# Altium project slave-12-ltc6811-1.PrjPcb (part 3 of 4)

## Sheet primary_EEPROM_and_T.SchDoc: foxBMS BMS-Slave 12-Cell
size A3; DocumentNumber: 14; SheetNumber: 14; SheetTotal: 21; AUTHOR: Fraunhofer IISB foxBMS Team; SheetDescription: Primary EEPROM and Board T-Sensor
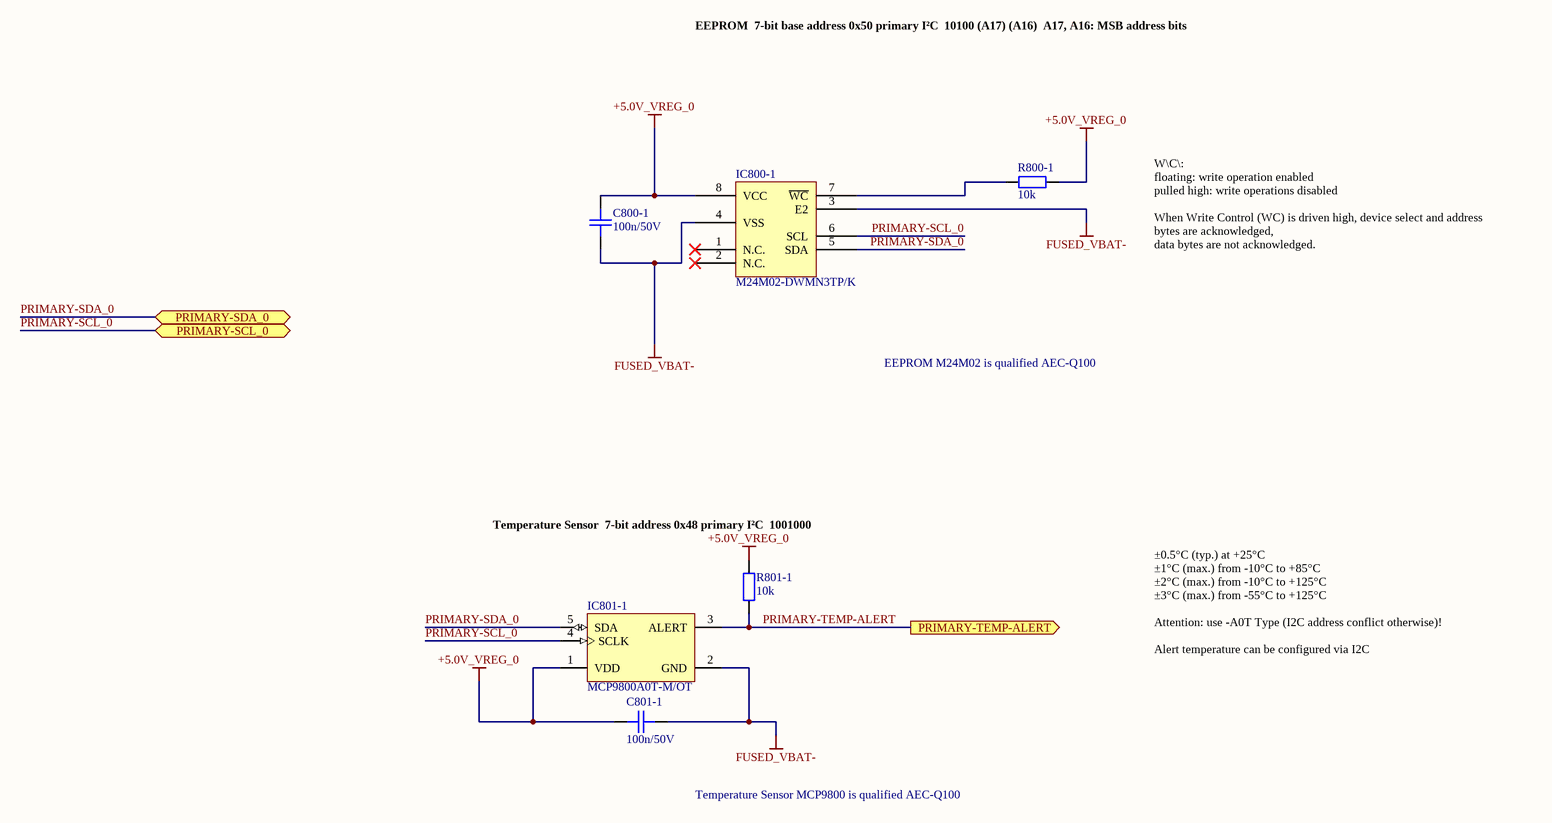
[diagram p12: primary_EEPROM_and_T.SchDoc]

### Parts
C800-1  100n/50V  [CAPC1608X08N]
C801-1  100n/50V  [CAPC1608X08N]
IC800-1  M24M02-DWMN3TP/K  [SOIC127P600X175-8N]
IC801-1  MCP9800A0T-M/OT  [SOT-23-OT5_L]
R800-1  10k  [RESC1608X05N]
R801-1  10k  [RESC1608X05N]

### Ports
PRIMARY-SCL_0 (bidir), PRIMARY-SDA_0 (bidir), PRIMARY-TEMP-ALERT (out)

### Nets
+5.0V_VREG_0: C800-1.2 C801-1.2 IC800-1.8(VCC) IC801-1.1(VDD) R800-1.2 R801-1.2
FUSED_VBAT-: C800-1.1 C801-1.1 IC800-1.3(E2) IC800-1.4(VSS) IC801-1.2(GND)
PRIMARY-SCL_0: IC800-1.6(SCL) IC801-1.4(SCLK) ; port PRIMARY-SCL_0
PRIMARY-SDA_0: IC800-1.5(SDA) IC801-1.5(SDA) ; port PRIMARY-SDA_0
PRIMARY-TEMP-ALERT: IC801-1.3(ALERT) R801-1.1 ; port PRIMARY-TEMP-ALERT
NetIC800-1_7: IC800-1.7(~{WC}) R800-1.1

Not connected (* = marked no-connect by the designer): IC800-1 1(N.C.)* 2(N.C.)*

### Notes on the sheet
- EEPROM
  7-bit base address 0x50 primary I²C
  10100 (A17) (A16)
  A17, A16: MSB address bits
- EEPROM M24M02 is qualified AEC-Q100
- W\C\:
  floating: write operation enabled
  pulled high: write operations disabled
  When Write Control (WC) is driven high, device select and address bytes are acknowledged,
  data bytes are not acknowledged.
- (near R801-1) Temperature Sensor
  7-bit address 0x48 primary I²C
  1001000
- ±0.5°C (typ.) at +25°C
  ±1°C (max.) from -10°C to +85°C
  ±2°C (max.) from -10°C to +125°C
  ±3°C (max.) from -55°C to +125°C
  Attention: use -A0T Type (I2C address conflict otherwise)!
  Alert temperature can be configured via I2C
- Temperature Sensor MCP9800 is qualified AEC-Q100
- Fraunhofer IISB
- Schottkystr. 10
- developed by:
- 91058 Erlangen
- Germany
- Author
- Project
- License
- Description
- File
- Version
- Release Date
- Sheet
- www.foxbms.org
- www.iisb.fraunhofer.de
- foxBMS Team
- /

### Library data of the parts
C800-1 C801-1 = gen_C_ceramic_100n_50V_X7R_0603: MLCC; Capacitance: 100n; Rated Voltage: 50V; Dielectric: X7R; Case EIA: 0603; Case Metric: 1608; PnP Package: C_0603_10; PnP Value: 100n/50V/X7R; PnP equipped: x; Automotive Qualified: False; Part Number: gen_C_ceramic_100n_50V_X7R_0603; Supplier 1: Farnell; Supplier Part Number 1: 2525267; Supplier 2: Digikey; Supplier Part Number 2: 490-6049-1-ND
IC800-1 = M24M02-DWMN3TP/K: Automotive 2-Mbit serial I²C / bus EEPROM with 1 MHz clock; Manufacturer: STMicroelectronics; PnP Package: SO8N; Automotive Qualified: True; Part Number: M24M02-DWMN3TP/K; Part Name: M24M02-DWMN3TP/K; Operating Temperature: -40°C - +125°C; ComponentLink1Description: Datasheet; ComponentLink1URL: http://www.st.com/content/ccc/resource/technical/document/datasheet/83/f4/3e/e4/4e/49/42/c5/DM00200595.pdf/files/DM00200595.pdf/jcr:content/translations/en.DM00200595.pdf; Supplier 1: Digikey; Supplier Part Number 1: 497-16238-1-ND; Supplier 2: Mouser; Supplier Part Number 2: 511-M24M02-DWMN3TP/K
IC801-1 = CMP-0192-00211-1: 2-Wire High-Accuracy Temperature Sensor, Slave Address 000, 5-Pin SOT-23, -55°C to +125°C Temperature, Tape and Reel; PackageReference: SOT-23-OT5; PackageVersion: revBB, Aug-2009; DatasheetVersion: revD, Nov-2010; PackageDescription: 5-Lead Plastic Small Outline Transistor (OT) [SOT-23]; Code_IPC: SOT23-5
R800-1 R801-1 = gen_R_10k_0603: as R700-1 on sheet primary_DIO; Part Number: gen_R_10k_0603; Operating Temperature: -55°C - +155°C; Resistance: 10k; Series: E24, E96; PnP Value: 10k; Supplier 1: Farnell; Supplier Part Number 1: 2073349

## Sheet secondary_EEPROM_and_T.SchDoc: foxBMS BMS-Slave 12-Cell
size A3; DocumentNumber: 20; SheetNumber: 20; SheetTotal: 21; AUTHOR: Fraunhofer IISB foxBMS Team; SheetDescription: Secondary EEPROM and Board T-Sensor
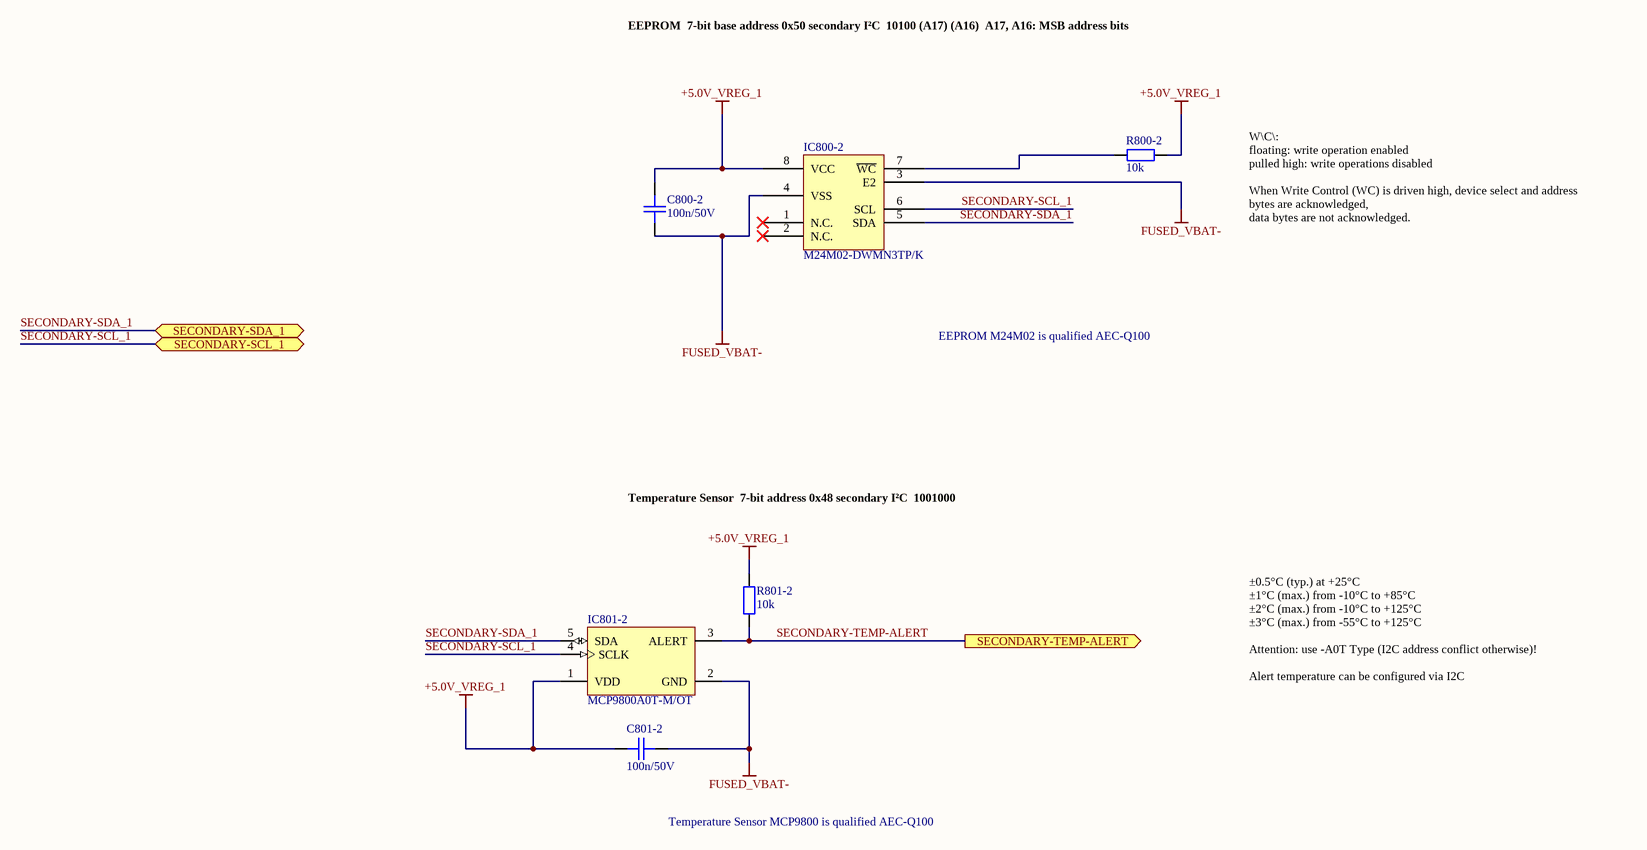
[diagram p13: secondary_EEPROM_and_T.SchDoc]

### Parts
C800-2  100n/50V  [CAPC1608X08N]
C801-2  100n/50V  [CAPC1608X08N]
IC800-2  M24M02-DWMN3TP/K  [SOIC127P600X175-8N]
IC801-2  MCP9800A0T-M/OT  [SOT-23-OT5_L]
R800-2  10k  [RESC1608X05N]
R801-2  10k  [RESC1608X05N]

### Ports
SECONDARY-SCL_1 (bidir), SECONDARY-SDA_1 (bidir), SECONDARY-TEMP-ALERT (out)

### Nets
+5.0V_VREG_1: C800-2.2 C801-2.2 IC800-2.8(VCC) IC801-2.1(VDD) R800-2.2 R801-2.2
FUSED_VBAT-: C800-2.1 C801-2.1 IC800-2.3(E2) IC800-2.4(VSS) IC801-2.2(GND)
SECONDARY-SCL_1: IC800-2.6(SCL) IC801-2.4(SCLK) ; port SECONDARY-SCL_1
SECONDARY-SDA_1: IC800-2.5(SDA) IC801-2.5(SDA) ; port SECONDARY-SDA_1
SECONDARY-TEMP-ALERT: IC801-2.3(ALERT) R801-2.1 ; port SECONDARY-TEMP-ALERT
NetIC800-2_7: IC800-2.7(~{WC}) R800-2.1

Not connected (* = marked no-connect by the designer): IC800-2 1(N.C.)* 2(N.C.)*

### Notes on the sheet
- EEPROM
  7-bit base address 0x50 secondary I²C
  10100 (A17) (A16)
  A17, A16: MSB address bits
- W\C\:
  floating: write operation enabled
  pulled high: write operations disabled
  When Write Control (WC) is driven high, device select and address bytes are acknowledged,
  data bytes are not acknowledged.
- EEPROM M24M02 is qualified AEC-Q100
- Temperature Sensor
  7-bit address 0x48 secondary I²C
  1001000
- ±0.5°C (typ.) at +25°C
  ±1°C (max.) from -10°C to +85°C
  ±2°C (max.) from -10°C to +125°C
  ±3°C (max.) from -55°C to +125°C
  Attention: use -A0T Type (I2C address conflict otherwise)!
  Alert temperature can be configured via I2C
- Temperature Sensor MCP9800 is qualified AEC-Q100
- Fraunhofer IISB
- Schottkystr. 10
- developed by:
- 91058 Erlangen
- Germany
- Author
- Project
- License
- Description
- File
- Version
- Release Date
- Sheet
- www.foxbms.org
- www.iisb.fraunhofer.de
- foxBMS Team
- /

### Library data of the parts
C800-2 C801-2 = gen_C_ceramic_100n_50V_X7R_0603: as C800-1 on sheet primary_EEPROM_and_T; Part Number: gen_C_ceramic_100n_50V_X7R_0603; Supplier 1: Farnell; Supplier Part Number 1: 2525267; Supplier 2: Digikey; Supplier Part Number 2: 490-6049-1-ND
IC800-2 = M24M02-DWMN3TP/K: as IC800-1 on sheet primary_EEPROM_and_T; Part Number: M24M02-DWMN3TP/K; Part Name: M24M02-DWMN3TP/K; Operating Temperature: -40°C - +125°C; ComponentLink1Description: Datasheet; ComponentLink1URL: http://www.st.com/content/ccc/resource/technical/document/datasheet/83/f4/3e/e4/4e/49/42/c5/DM00200595.pdf/files/DM00200595.pdf/jcr:content/translations/en.DM00200595.pdf; Supplier 1: Digikey; Supplier Part Number 1: 497-16238-1-ND; Supplier 2: Mouser; Supplier Part Number 2: 511-M24M02-DWMN3TP/K
IC801-2 = CMP-0192-00211-1: as IC801-1 on sheet primary_EEPROM_and_T; PackageReference: SOT-23-OT5; PackageVersion: revBB, Aug-2009; DatasheetVersion: revD, Nov-2010; PackageDescription: 5-Lead Plastic Small Outline Transistor (OT) [SOT-23]; Code_IPC: SOT23-5
R800-2 R801-2 = gen_R_10k_0603: as R700-1 on sheet primary_DIO; Part Number: gen_R_10k_0603; Operating Temperature: -55°C - +155°C; Resistance: 10k; Series: E24, E96; PnP Value: 10k; Supplier 1: Farnell; Supplier Part Number 1: 2073349

## Sheet prim_analog_in.SchDoc: foxBMS BMS-Slave 12-Cell
size A3; DocumentNumber: 10; SheetNumber: 10; SheetTotal: 21; AUTHOR: Fraunhofer IISB foxBMS Team; SheetDescription: Primary Analog Inputs
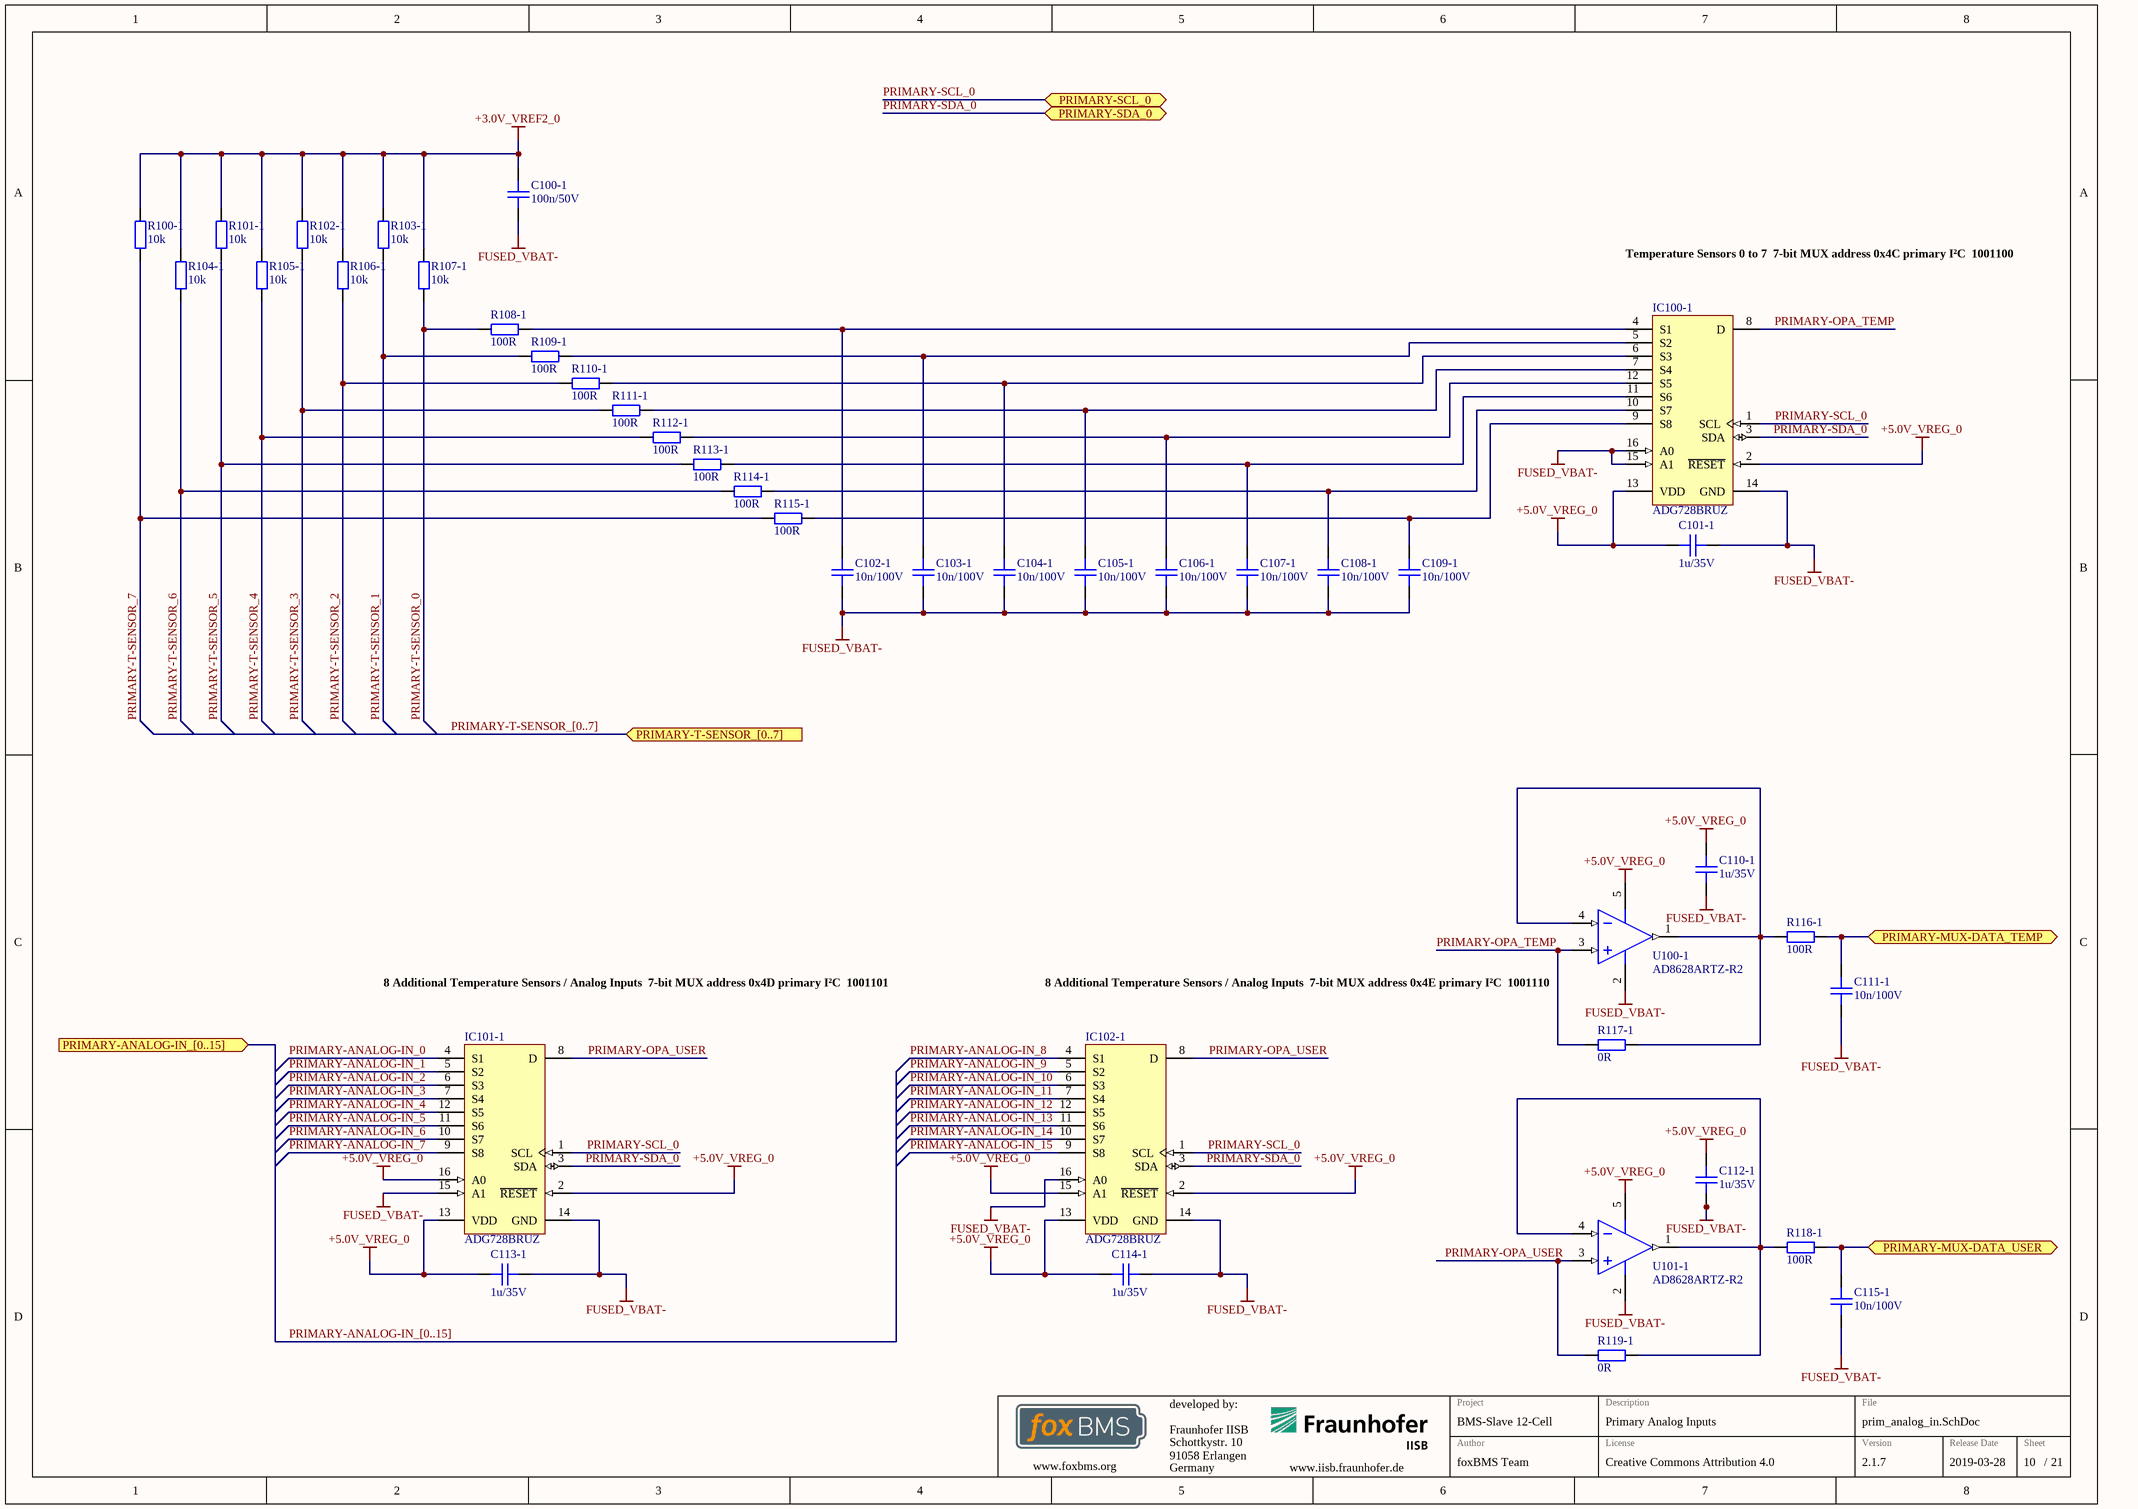
[diagram p14: prim_analog_in.SchDoc]

### Parts
C100-1  100n/50V  [CAPC1608X08N]
C101-1  1u/35V  [CAPC1608X08N]
C102-1  10n/100V  [CAPC1608X08N]
C103-1  10n/100V  [CAPC1608X08N]
C104-1  10n/100V  [CAPC1608X08N]
C105-1  10n/100V  [CAPC1608X08N]
C106-1  10n/100V  [CAPC1608X08N]
C107-1  10n/100V  [CAPC1608X08N]
C108-1  10n/100V  [CAPC1608X08N]
C109-1  10n/100V  [CAPC1608X08N]
C110-1  1u/35V  [CAPC1608X08N]
C111-1  10n/100V  [CAPC1608X08N]
C112-1  1u/35V  [CAPC1608X08N]
C113-1  1u/35V  [CAPC1608X08N]
C114-1  1u/35V  [CAPC1608X08N]
C115-1  10n/100V  [CAPC1608X08N]
IC100-1  ADG728BRUZ  [ADI-RU-16_M]
IC101-1  ADG728BRUZ  [ADI-RU-16_M]
IC102-1  ADG728BRUZ  [ADI-RU-16_M]
R100-1  10k  [RESC1608X05N]
R101-1  10k  [RESC1608X05N]
R102-1  10k  [RESC1608X05N]
R103-1  10k  [RESC1608X05N]
R104-1  10k  [RESC1608X05N]
R105-1  10k  [RESC1608X05N]
R106-1  10k  [RESC1608X05N]
R107-1  10k  [RESC1608X05N]
R108-1  100R  [RESC1608X05N]
R109-1  100R  [RESC1608X05N]
R110-1  100R  [RESC1608X05N]
R111-1  100R  [RESC1608X05N]
R112-1  100R  [RESC1608X05N]
R113-1  100R  [RESC1608X05N]
R114-1  100R  [RESC1608X05N]
R115-1  100R  [RESC1608X05N]
R116-1  100R  [RESC1608X05N]
R117-1  0R  [RESC1608X05N]
R118-1  100R  [RESC1608X05N]
R119-1  0R  [RESC1608X05N]
U100-1  AD8628ARTZ-R2  [ADI-RJ-5_M]
U101-1  AD8628ARTZ-R2  [ADI-RJ-5_M]

### Ports
PRIMARY-ANALOG-IN_[0..15] (in), PRIMARY-MUX-DATA_TEMP (bidir), PRIMARY-MUX-DATA_USER (bidir), PRIMARY-SCL_0 (bidir), PRIMARY-SDA_0 (bidir), PRIMARY-T-SENSOR_[0..7] (in)

### Nets
+3.0V_VREF2_0: C100-1.2 R100-1.2 R101-1.2 R102-1.2 R103-1.2 R104-1.2 R105-1.2 R106-1.2 R107-1.2
+5.0V_VREG_0: C101-1.2 C110-1.2 C112-1.2 C113-1.2 C114-1.2 IC100-1.2(~{RESET}) IC100-1.13(VDD) IC101-1.2(~{RESET}) IC101-1.13(VDD) IC101-1.16(A0) IC102-1.2(~{RESET}) IC102-1.13(VDD) IC102-1.15(A1) U100-1.5(+V) U101-1.5(+V)
FUSED_VBAT-: C100-1.1 C101-1.1 C102-1.1 C103-1.1 C104-1.1 C105-1.1 C106-1.1 C107-1.1 C108-1.1 C109-1.1 C110-1.1 C111-1.1 C112-1.1 C113-1.1 C114-1.1 C115-1.1 IC100-1.14(GND) IC100-1.15(A1) IC100-1.16(A0) IC101-1.14(GND) IC101-1.15(A1) IC102-1.14(GND) IC102-1.16(A0) U100-1.2(-V) U101-1.2(-V)
PRIMARY-ANALOG-IN_0: IC101-1.4(S1)
PRIMARY-ANALOG-IN_1: IC101-1.5(S2)
PRIMARY-ANALOG-IN_2: IC101-1.6(S3)
PRIMARY-ANALOG-IN_3: IC101-1.7(S4)
PRIMARY-ANALOG-IN_4: IC101-1.12(S5)
PRIMARY-ANALOG-IN_5: IC101-1.11(S6)
PRIMARY-ANALOG-IN_6: IC101-1.10(S7)
PRIMARY-ANALOG-IN_7: IC101-1.9(S8)
PRIMARY-ANALOG-IN_8: IC102-1.4(S1)
PRIMARY-ANALOG-IN_9: IC102-1.5(S2)
PRIMARY-ANALOG-IN_10: IC102-1.6(S3)
PRIMARY-ANALOG-IN_11: IC102-1.7(S4)
PRIMARY-ANALOG-IN_12: IC102-1.12(S5)
PRIMARY-ANALOG-IN_13: IC102-1.11(S6)
PRIMARY-ANALOG-IN_14: IC102-1.10(S7)
PRIMARY-ANALOG-IN_15: IC102-1.9(S8)
PRIMARY-MUX-DATA_TEMP: C111-1.2 R116-1.2 ; port PRIMARY-MUX-DATA_TEMP
PRIMARY-MUX-DATA_USER: C115-1.2 R118-1.2 ; port PRIMARY-MUX-DATA_USER
PRIMARY-OPA_TEMP: IC100-1.8(D) R117-1.1 U100-1.3(+IN)
PRIMARY-OPA_USER: IC101-1.8(D) IC102-1.8(D) R119-1.1 U101-1.3(+IN)
PRIMARY-SCL_0: IC100-1.1(SCL) IC101-1.1(SCL) IC102-1.1(SCL) ; port PRIMARY-SCL_0
PRIMARY-SDA_0: IC100-1.3(SDA) IC101-1.3(SDA) IC102-1.3(SDA) ; port PRIMARY-SDA_0
PRIMARY-T-SENSOR_0: R107-1.1 R108-1.2
PRIMARY-T-SENSOR_1: R103-1.1 R109-1.2
PRIMARY-T-SENSOR_2: R106-1.1 R110-1.2
PRIMARY-T-SENSOR_3: R102-1.1 R111-1.2
PRIMARY-T-SENSOR_4: R105-1.1 R112-1.2
PRIMARY-T-SENSOR_5: R101-1.1 R113-1.2
PRIMARY-T-SENSOR_6: R104-1.1 R114-1.2
PRIMARY-T-SENSOR_7: R100-1.1 R115-1.2
NetC102-1_2: C102-1.2 IC100-1.4(S1) R108-1.1
NetC103-1_2: C103-1.2 IC100-1.5(S2) R109-1.1
NetC104-1_2: C104-1.2 IC100-1.6(S3) R110-1.1
NetC105-1_2: C105-1.2 IC100-1.7(S4) R111-1.1
NetC106-1_2: C106-1.2 IC100-1.12(S5) R112-1.1
NetC107-1_2: C107-1.2 IC100-1.11(S6) R113-1.1
NetC108-1_2: C108-1.2 IC100-1.10(S7) R114-1.1
NetC109-1_2: C109-1.2 IC100-1.9(S8) R115-1.1
NetR116-1_1: R116-1.1 R117-1.2 U100-1.1(OUT) U100-1.4(-IN)
NetR118-1_1: R118-1.1 R119-1.2 U101-1.1(OUT) U101-1.4(-IN)

### Buses and harness runs
bus PRIMARY-ANALOG-IN_[0..15] = port PRIMARY-ANALOG-IN_[0..15]
bus PRIMARY-T-SENSOR_[0..7] = port PRIMARY-T-SENSOR_[0..7]

### Notes on the sheet
- Temperature Sensors 0 to 7
  7-bit MUX address 0x4C primary I²C
  1001100
- 8 Additional Temperature Sensors / Analog Inputs
  7-bit MUX address 0x4D primary I²C
  1001101
- (near U100-1) 8 Additional Temperature Sensors / Analog Inputs
  7-bit MUX address 0x4E primary I²C
  1001110
- Fraunhofer IISB
- Schottkystr. 10
- developed by:
- 91058 Erlangen
- Germany
- Author
- Project
- License
- Description
- File
- Version
- Release Date
- Sheet
- www.foxbms.org
- www.iisb.fraunhofer.de
- foxBMS Team
- /

### Library data of the parts
C100-1 = gen_C_ceramic_100n_50V_X7R_0603: as C700-1 on sheet primary_DIO; Part Number: gen_C_ceramic_100n_50V_X7R_0603; Supplier 1: Farnell; Supplier Part Number 1: 2525267; Supplier 2: Digikey; Supplier Part Number 2: 490-6049-1-ND; Supplier 3: Farnell; Supplier Part Number 3: 2070398
C101-1 C110-1 C112-1 C113-1 C114-1 = gen_C_ceramic_1u_35V_X7R_0603: as C1401-1 on sheet primary_LTC; Part Number: gen_C_ceramic_1u_35V_X7R_0603; Supplier 1: Farnell; Supplier Part Number 1: 1907508
C102-1 C103-1 C104-1 C105-1 C106-1 C107-1 C108-1 C109-1 C111-1 C115-1 = gen_C_ceramic_10n_100V_X7R_0603: MLCC; Capacitance: 10n; Rated Voltage: 100V; Dielectric: X7R; Case EIA: 0603; Case Metric: 1608; Automotive Qualified: True; PnP Package: C_0603_10; PnP Value: 10n/100V/X7R; Part Number: gen_C_ceramic_10n_100V_X7R_0603; Supplier 1: Farnell; Supplier Part Number 1: 1301715; Supplier 2: Farnell; Supplier Part Number 2: 2821192; Supplier 3: Farnell; Supplier Part Number 3: 2210878
IC100-1 IC101-1 IC102-1 = CMP-0798-00197-1: CMOS, Low Voltage, 2-Wire Serially Controlled, Matrix Switch, -40 to 85 degC, 16-pin SOP (RU-16), Tube; Manufacturer: Analog Devices; Ron (ohms): 2.5; Supply V Guar Performance: Single_(+3V), Single_(+5V); Max Analog Signal Range: 0 to Vdd; Bandwidth (Hz): 65M; ComponentLink3Description: Package Specification; Packing: Tube; PartNumber: ADG728BRUZ; ComponentLink1URL: http://www.analog.com/en/index.html; Mounting Technology: Surface Mount; DatasheetVersion: Rev. C; ComponentLink1Description: Manufacturer URL; ComponentLink3URL: http:/www.analog.com/static/imported-files/packages/36244347913743854010197452789RU16.pdf; ComponentLink2URL: http://www.analog.com/static/imported-files/data_sheets/ADG728_729.pdf; PackageVersion: Nov-02; PackageDescription: 16-Pin Thin Shrink Small Outline Package, Body 5 x 4.4 mm, Pitch 0.65 mm; Code_JEDEC: MO-153AB; PackageReference: RU-16; ComponentLink2Description: Datasheet
R100-1 R101-1 R102-1 R103-1 R104-1 R105-1 R106-1 R107-1 = gen_R_10k_0603: as R1404-1 on sheet primary_LTC; Part Number: gen_R_10k_0603; Operating Temperature: -55°C - +155°C; Resistance: 10k; Series: E24, E96; PnP Value: 10k; Supplier 1: Farnell; Supplier Part Number 1: 2073349
R108-1 R109-1 R110-1 R111-1 R112-1 R113-1 R114-1 R115-1 = gen_R_100R_0603: SMD Resistor 100R 0603; Tolerance: 1%; Power: 0.1W; Case EIA: 0603; Case Metric: 1608; Maximum Working Voltage: 75V; PnP Package: R_0603; Automotive Qualified: True; Part Number: gen_R_100R_0603; Operating Temperature: -55°C - +155°C; Resistance: 100R; Series: E24, E96; PnP Value: 100R; Supplier 1: Digikey; Supplier Part Number 1: P100HCT-ND
R116-1 R118-1 = gen_R_100R_0603: SMD Resistor 100R 0603; Tolerance: 1%; Power: 0.1W; Case EIA: 0603; Case Metric: 1608; Maximum Working Voltage: 75V; PnP Package: R_0603; Automotive Qualified: False; Part Number: gen_R_100R_0603; Operating Temperature: -55°C - +155°C; Resistance: 100R; Series: E24, E96; PnP Value: 100R; Supplier 1: Farnell; Supplier Part Number 1: 1469752
R117-1 R119-1 = gen_R_0R_0603: SMD Resistor 0R 0603; Power: 0.1W; Case EIA: 0603; Case Metric: 1608; Maximum Working Voltage: 75V; PnP Package: R_0603; Automotive Qualified: True; Part Number: gen_R_0R_0603; Operating Temperature: -55°C - +155°C; Resistance: 0R; Series: Jumper; PnP Value: 0R; Supplier 1: Farnell; Supplier Part Number 1: 2616580
U100-1 U101-1 = CMP-0384-01512-2: Single Channel RRIO Operational Amplifier, 2.5 MHz BW, 1 V/us SR, Industrial, 5-pin SOT23 (RJ-5), Reel; Manufacturer: Analog Devices; Generic Part Number: AD8628; Iq/Amp: 1.1mA; Automotive Qualified: Yes; V Span Max: 6V; Input Bias Current: 30pA; Slew Rate: 1V/us; Amplifiers Per Package: 1; Input Offset Voltage: 1uV; Small Signal Bandwidth: 2.5MHz; V Span Min: 2.7V; ComponentLink1Description: Manufacturer URL; DatasheetVersion: Rev. I; ComponentLink4Description: Reference Circuit; Code_JEDEC: MO-178-AA; PackageDescription: 5-Pin Small Outline Transistor Package, Body 2.9 x 1.6 mm, Pitch 0.95 mm; ComponentLink3URL: http://www.analog.com/static/imported-files/packages/PKG_PDF/SOT-23(RJ)/RJ_5.pdf; PackageReference: RJ-5; ComponentLink1URL: http://www.analog.com/en/index.html; PackageVersion: 121608-A; RevisionNote: Reference Circuit URL fixed; Mounting Technology: Surface Mount; ComponentLink2Description: Datasheet; ComponentLink3Description: Package Specification; ComponentLink4URL: http://www.analog.com/en/all-operational-amplifiers-op-amps/operational-amplifiers-op-amps/ad8628/products/product.html#product-recommendations; ComponentLink2URL: http://www.analog.com/static/imported-files/data_sheets/AD8628_8629_8630.pdf; PartNumber: AD8628ARTZ-R2

## Sheet secon_analog_in.SchDoc: foxBMS BMS-Slave 12-Cell
size A3; DocumentNumber: 16; SheetNumber: 16; SheetTotal: 21; AUTHOR: Fraunhofer IISB foxBMS Team; SheetDescription: Secondary Analog Inputs
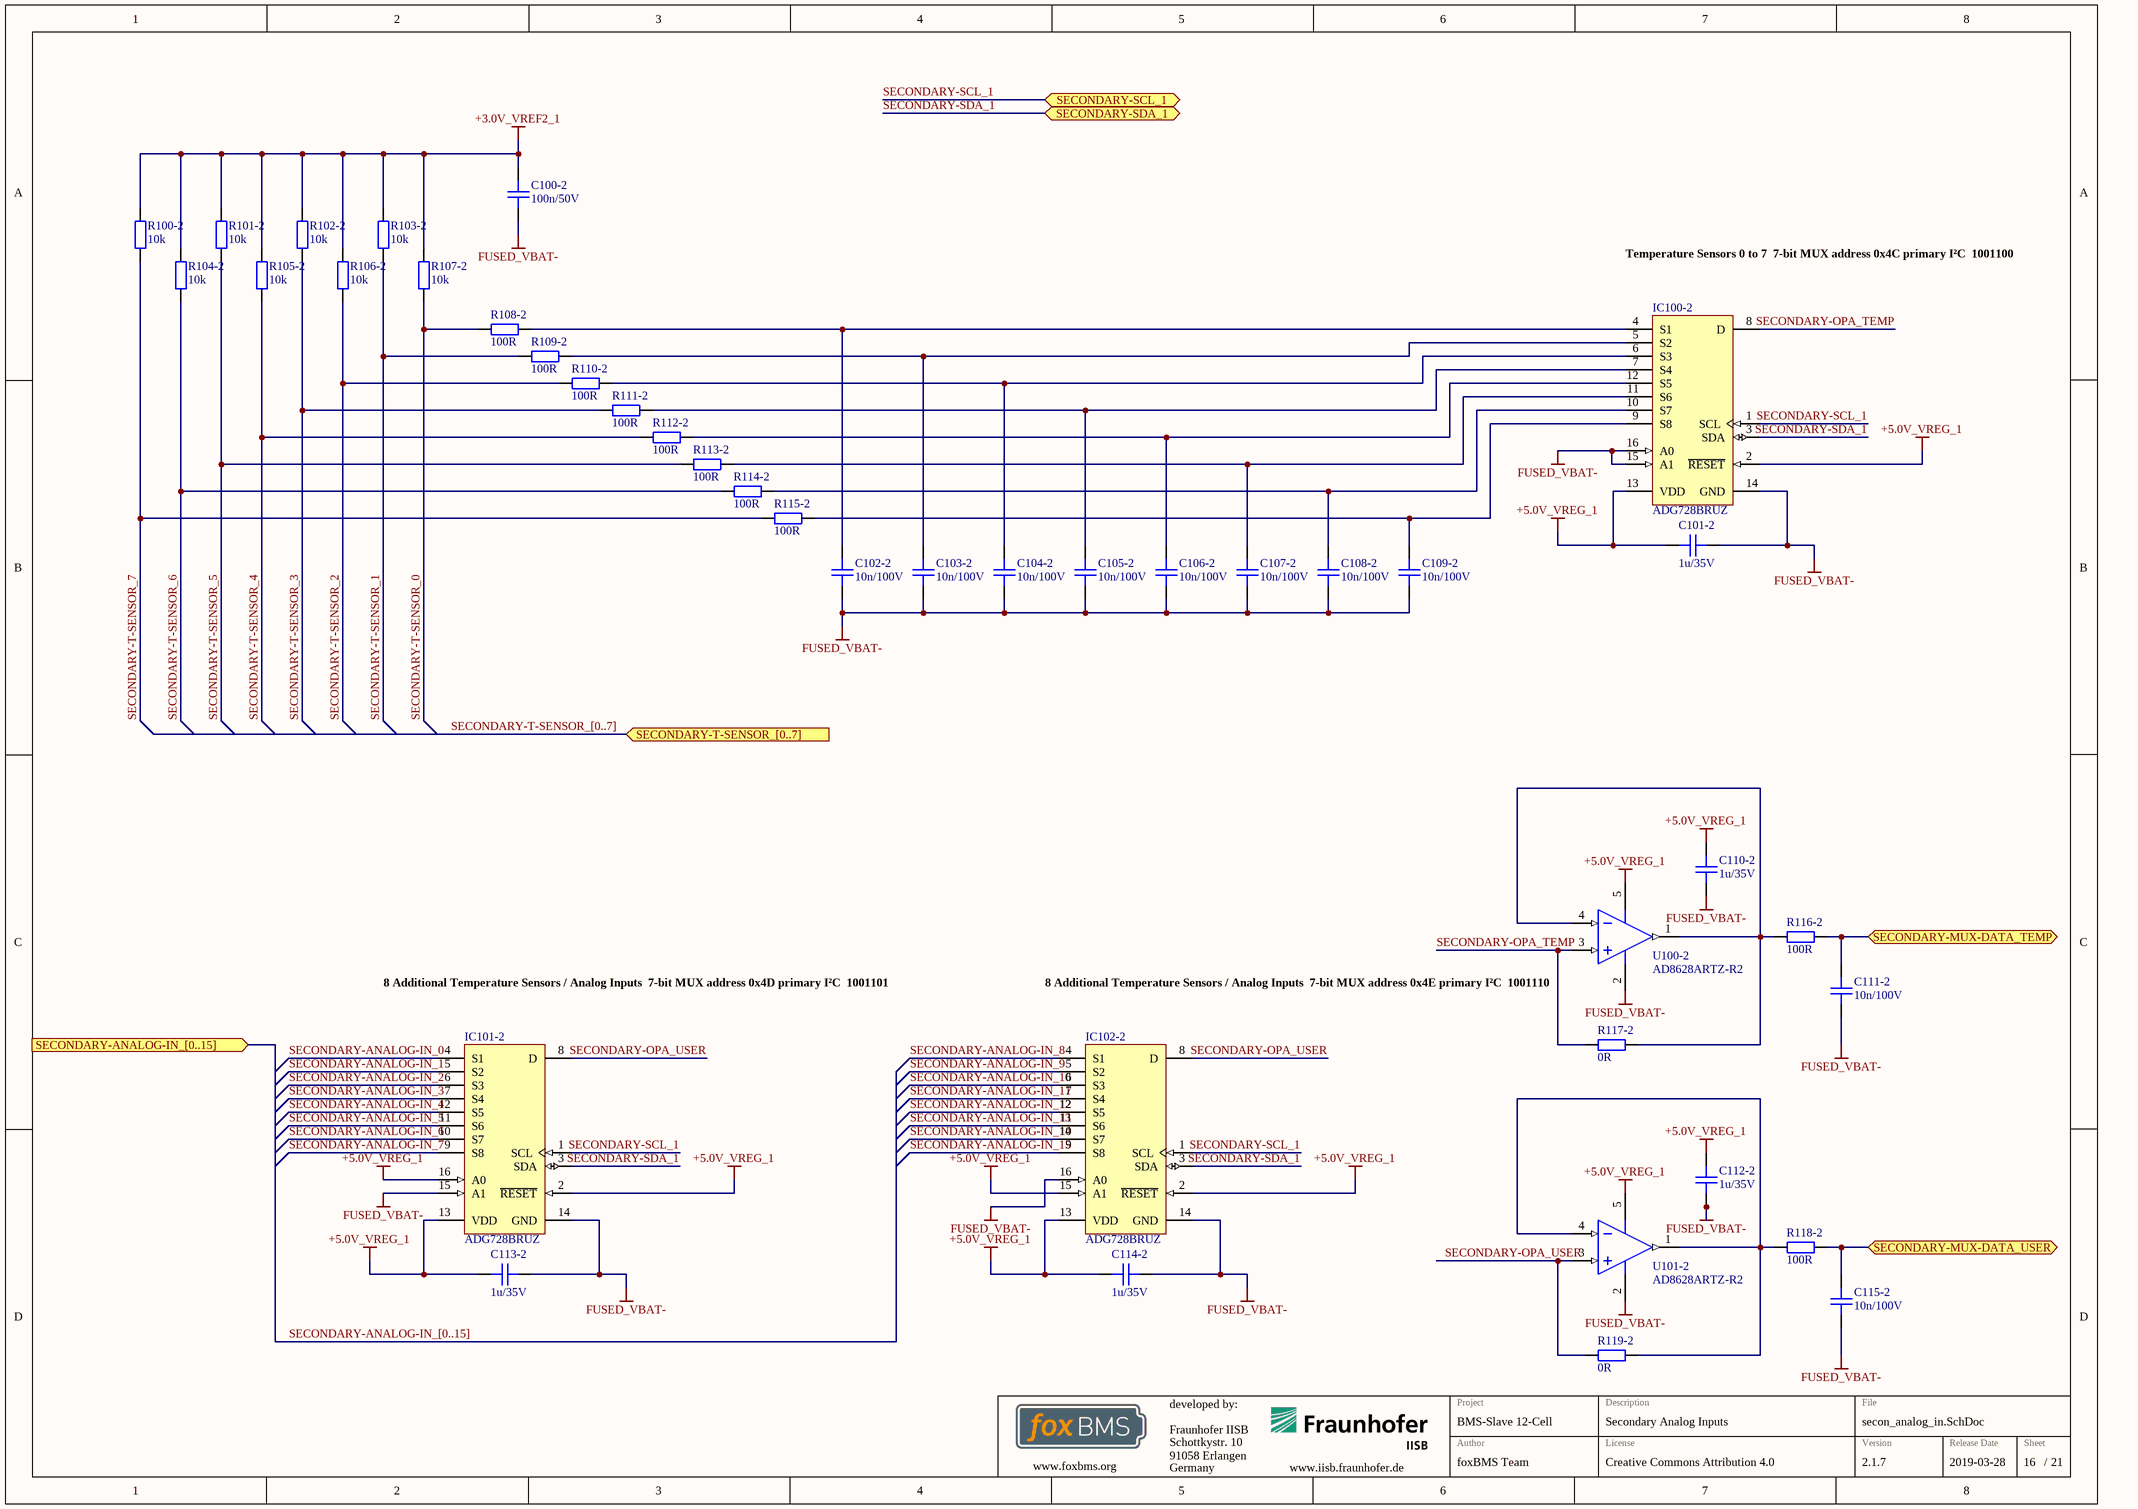
[diagram p15: secon_analog_in.SchDoc]

### Parts
C100-2  100n/50V  [CAPC1608X08N]
C101-2  1u/35V  [CAPC1608X08N]
C102-2  10n/100V  [CAPC1608X08N]
C103-2  10n/100V  [CAPC1608X08N]
C104-2  10n/100V  [CAPC1608X08N]
C105-2  10n/100V  [CAPC1608X08N]
C106-2  10n/100V  [CAPC1608X08N]
C107-2  10n/100V  [CAPC1608X08N]
C108-2  10n/100V  [CAPC1608X08N]
C109-2  10n/100V  [CAPC1608X08N]
C110-2  1u/35V  [CAPC1608X08N]
C111-2  10n/100V  [CAPC1608X08N]
C112-2  1u/35V  [CAPC1608X08N]
C113-2  1u/35V  [CAPC1608X08N]
C114-2  1u/35V  [CAPC1608X08N]
C115-2  10n/100V  [CAPC1608X08N]
IC100-2  ADG728BRUZ  [ADI-RU-16_M]
IC101-2  ADG728BRUZ  [ADI-RU-16_M]
IC102-2  ADG728BRUZ  [ADI-RU-16_M]
R100-2  10k  [RESC1608X05N]
R101-2  10k  [RESC1608X05N]
R102-2  10k  [RESC1608X05N]
R103-2  10k  [RESC1608X05N]
R104-2  10k  [RESC1608X05N]
R105-2  10k  [RESC1608X05N]
R106-2  10k  [RESC1608X05N]
R107-2  10k  [RESC1608X05N]
R108-2  100R  [RESC1608X05N]
R109-2  100R  [RESC1608X05N]
R110-2  100R  [RESC1608X05N]
R111-2  100R  [RESC1608X05N]
R112-2  100R  [RESC1608X05N]
R113-2  100R  [RESC1608X05N]
R114-2  100R  [RESC1608X05N]
R115-2  100R  [RESC1608X05N]
R116-2  100R  [RESC1608X05N]
R117-2  0R  [RESC1608X05N]
R118-2  100R  [RESC1608X05N]
R119-2  0R  [RESC1608X05N]
U100-2  AD8628ARTZ-R2  [ADI-RJ-5_M]
U101-2  AD8628ARTZ-R2  [ADI-RJ-5_M]

### Ports
SECONDARY-ANALOG-IN_[0..15] (in), SECONDARY-MUX-DATA_TEMP (bidir), SECONDARY-MUX-DATA_USER (bidir), SECONDARY-SCL_1 (bidir), SECONDARY-SDA_1 (bidir), SECONDARY-T-SENSOR_[0..7] (in)

### Nets
+3.0V_VREF2_1: C100-2.2 R100-2.2 R101-2.2 R102-2.2 R103-2.2 R104-2.2 R105-2.2 R106-2.2 R107-2.2
+5.0V_VREG_1: C101-2.2 C110-2.2 C112-2.2 C113-2.2 C114-2.2 IC100-2.2(~{RESET}) IC100-2.13(VDD) IC101-2.2(~{RESET}) IC101-2.13(VDD) IC101-2.16(A0) IC102-2.2(~{RESET}) IC102-2.13(VDD) IC102-2.15(A1) U100-2.5(+V) U101-2.5(+V)
FUSED_VBAT-: C100-2.1 C101-2.1 C102-2.1 C103-2.1 C104-2.1 C105-2.1 C106-2.1 C107-2.1 C108-2.1 C109-2.1 C110-2.1 C111-2.1 C112-2.1 C113-2.1 C114-2.1 C115-2.1 IC100-2.14(GND) IC100-2.15(A1) IC100-2.16(A0) IC101-2.14(GND) IC101-2.15(A1) IC102-2.14(GND) IC102-2.16(A0) U100-2.2(-V) U101-2.2(-V)
SECONDARY-ANALOG-IN_0: IC101-2.4(S1)
SECONDARY-ANALOG-IN_1: IC101-2.5(S2)
SECONDARY-ANALOG-IN_2: IC101-2.6(S3)
SECONDARY-ANALOG-IN_3: IC101-2.7(S4)
SECONDARY-ANALOG-IN_4: IC101-2.12(S5)
SECONDARY-ANALOG-IN_5: IC101-2.11(S6)
SECONDARY-ANALOG-IN_6: IC101-2.10(S7)
SECONDARY-ANALOG-IN_7: IC101-2.9(S8)
SECONDARY-ANALOG-IN_8: IC102-2.4(S1)
SECONDARY-ANALOG-IN_9: IC102-2.5(S2)
SECONDARY-ANALOG-IN_10: IC102-2.6(S3)
SECONDARY-ANALOG-IN_11: IC102-2.7(S4)
SECONDARY-ANALOG-IN_12: IC102-2.12(S5)
SECONDARY-ANALOG-IN_13: IC102-2.11(S6)
SECONDARY-ANALOG-IN_14: IC102-2.10(S7)
SECONDARY-ANALOG-IN_15: IC102-2.9(S8)
SECONDARY-MUX-DATA_TEMP: C111-2.2 R116-2.2 ; port SECONDARY-MUX-DATA_TEMP
SECONDARY-MUX-DATA_USER: C115-2.2 R118-2.2 ; port SECONDARY-MUX-DATA_USER
SECONDARY-OPA_TEMP: IC100-2.8(D) R117-2.1 U100-2.3(+IN)
SECONDARY-OPA_USER: IC101-2.8(D) IC102-2.8(D) R119-2.1 U101-2.3(+IN)
SECONDARY-SCL_1: IC100-2.1(SCL) IC101-2.1(SCL) IC102-2.1(SCL) ; port SECONDARY-SCL_1
SECONDARY-SDA_1: IC100-2.3(SDA) IC101-2.3(SDA) IC102-2.3(SDA) ; port SECONDARY-SDA_1
SECONDARY-T-SENSOR_0: R107-2.1 R108-2.2
SECONDARY-T-SENSOR_1: R103-2.1 R109-2.2
SECONDARY-T-SENSOR_2: R106-2.1 R110-2.2
SECONDARY-T-SENSOR_3: R102-2.1 R111-2.2
SECONDARY-T-SENSOR_4: R105-2.1 R112-2.2
SECONDARY-T-SENSOR_5: R101-2.1 R113-2.2
SECONDARY-T-SENSOR_6: R104-2.1 R114-2.2
SECONDARY-T-SENSOR_7: R100-2.1 R115-2.2
NetC102-2_2: C102-2.2 IC100-2.4(S1) R108-2.1
NetC103-2_2: C103-2.2 IC100-2.5(S2) R109-2.1
NetC104-2_2: C104-2.2 IC100-2.6(S3) R110-2.1
NetC105-2_2: C105-2.2 IC100-2.7(S4) R111-2.1
NetC106-2_2: C106-2.2 IC100-2.12(S5) R112-2.1
NetC107-2_2: C107-2.2 IC100-2.11(S6) R113-2.1
NetC108-2_2: C108-2.2 IC100-2.10(S7) R114-2.1
NetC109-2_2: C109-2.2 IC100-2.9(S8) R115-2.1
NetR116-2_1: R116-2.1 R117-2.2 U100-2.1(OUT) U100-2.4(-IN)
NetR118-2_1: R118-2.1 R119-2.2 U101-2.1(OUT) U101-2.4(-IN)

### Buses and harness runs
bus SECONDARY-ANALOG-IN_[0..15] = port SECONDARY-ANALOG-IN_[0..15]
bus SECONDARY-T-SENSOR_[0..7] = port SECONDARY-T-SENSOR_[0..7]

### Notes on the sheet
- Temperature Sensors 0 to 7
  7-bit MUX address 0x4C primary I²C
  1001100
- 8 Additional Temperature Sensors / Analog Inputs
  7-bit MUX address 0x4D primary I²C
  1001101
- (near U100-2) 8 Additional Temperature Sensors / Analog Inputs
  7-bit MUX address 0x4E primary I²C
  1001110
- Fraunhofer IISB
- Schottkystr. 10
- developed by:
- 91058 Erlangen
- Germany
- Author
- Project
- License
- Description
- File
- Version
- Release Date
- Sheet
- www.foxbms.org
- www.iisb.fraunhofer.de
- foxBMS Team
- /

### Library data of the parts
C100-2 = gen_C_ceramic_100n_50V_X7R_0603: as C700-1 on sheet primary_DIO; Part Number: gen_C_ceramic_100n_50V_X7R_0603; Supplier 1: Farnell; Supplier Part Number 1: 2525267; Supplier 2: Digikey; Supplier Part Number 2: 490-6049-1-ND; Supplier 3: Farnell; Supplier Part Number 3: 2070398
C101-2 C110-2 C112-2 C113-2 C114-2 = gen_C_ceramic_1u_35V_X7R_0603: as C1401-1 on sheet primary_LTC; Part Number: gen_C_ceramic_1u_35V_X7R_0603; Supplier 1: Farnell; Supplier Part Number 1: 1907508
C102-2 C103-2 C104-2 C105-2 C106-2 C107-2 C108-2 C109-2 C111-2 C115-2 = gen_C_ceramic_10n_100V_X7R_0603: as C102-1 on sheet prim_analog_in; Part Number: gen_C_ceramic_10n_100V_X7R_0603; Supplier 1: Farnell; Supplier Part Number 1: 1301715; Supplier 2: Farnell; Supplier Part Number 2: 2821192; Supplier 3: Farnell; Supplier Part Number 3: 2210878
IC100-2 IC101-2 IC102-2 = CMP-0798-00197-1: as IC100-1 on sheet prim_analog_in; ComponentLink3Description: Package Specification; Packing: Tube; PartNumber: ADG728BRUZ; ComponentLink1URL: http://www.analog.com/en/index.html; Mounting Technology: Surface Mount; DatasheetVersion: Rev. C; ComponentLink1Description: Manufacturer URL; ComponentLink3URL: http:/www.analog.com/static/imported-files/packages/36244347913743854010197452789RU16.pdf; ComponentLink2URL: http://www.analog.com/static/imported-files/data_sheets/ADG728_729.pdf; PackageVersion: Nov-02; PackageDescription: 16-Pin Thin Shrink Small Outline Package, Body 5 x 4.4 mm, Pitch 0.65 mm; Code_JEDEC: MO-153AB; PackageReference: RU-16; ComponentLink2Description: Datasheet
R100-2 R101-2 R102-2 R103-2 R104-2 R105-2 R106-2 R107-2 = gen_R_10k_0603: as R1404-1 on sheet primary_LTC; Part Number: gen_R_10k_0603; Operating Temperature: -55°C - +155°C; Resistance: 10k; Series: E24, E96; PnP Value: 10k; Supplier 1: Farnell; Supplier Part Number 1: 2073349
R108-2 R109-2 R110-2 R111-2 R112-2 R113-2 R114-2 R115-2 = gen_R_100R_0603: as R108-1 on sheet prim_analog_in; Part Number: gen_R_100R_0603; Operating Temperature: -55°C - +155°C; Resistance: 100R; Series: E24, E96; PnP Value: 100R; Supplier 1: Digikey; Supplier Part Number 1: P100HCT-ND
R116-2 R118-2 = gen_R_100R_0603: as R116-1 on sheet prim_analog_in; Part Number: gen_R_100R_0603; Operating Temperature: -55°C - +155°C; Resistance: 100R; Series: E24, E96; PnP Value: 100R; Supplier 1: Farnell; Supplier Part Number 1: 1469752
R117-2 R119-2 = gen_R_0R_0603: as R117-1 on sheet prim_analog_in; Part Number: gen_R_0R_0603; Operating Temperature: -55°C - +155°C; Resistance: 0R; Series: Jumper; PnP Value: 0R; Supplier 1: Farnell; Supplier Part Number 1: 2616580
U100-2 U101-2 = CMP-0384-01512-2: as U100-1 on sheet prim_analog_in; ComponentLink1Description: Manufacturer URL; DatasheetVersion: Rev. I; ComponentLink4Description: Reference Circuit; Code_JEDEC: MO-178-AA; PackageDescription: 5-Pin Small Outline Transistor Package, Body 2.9 x 1.6 mm, Pitch 0.95 mm; ComponentLink3URL: http://www.analog.com/static/imported-files/packages/PKG_PDF/SOT-23(RJ)/RJ_5.pdf; PackageReference: RJ-5; ComponentLink1URL: http://www.analog.com/en/index.html; PackageVersion: 121608-A; RevisionNote: Reference Circuit URL fixed; Mounting Technology: Surface Mount; ComponentLink2Description: Datasheet; ComponentLink3Description: Package Specification; ComponentLink4URL: http://www.analog.com/en/all-operational-amplifiers-op-amps/operational-amplifiers-op-amps/ad8628/products/product.html#product-recommendations; ComponentLink2URL: http://www.analog.com/static/imported-files/data_sheets/AD8628_8629_8630.pdf; PartNumber: AD8628ARTZ-R2

## Sheet daisy_chain_connectors.SchDoc
size A3; DocumentNumber: 5; SheetNumber: 5; SheetTotal: 21; SheetDescription: Daisy Chain Connectors
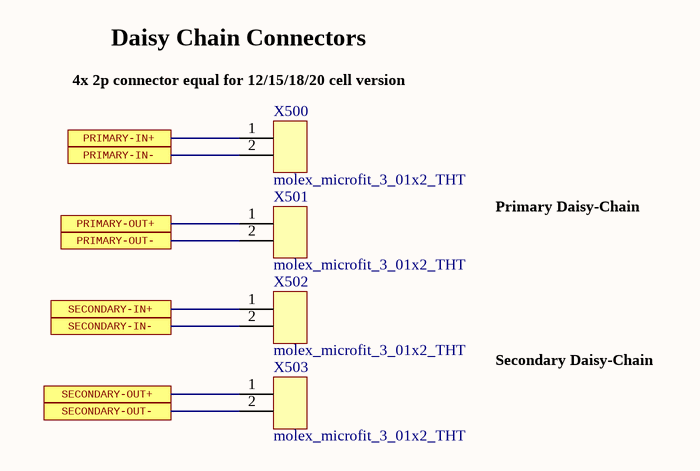
[diagram p16: daisy_chain_connectors.SchDoc]

### Parts
X500  molex_microfit_3_01x2_THT  [MOLEX_MICROFIT_01x2_THT]
X501  molex_microfit_3_01x2_THT  [MOLEX_MICROFIT_01x2_THT]
X502  molex_microfit_3_01x2_THT  [MOLEX_MICROFIT_01x2_THT]
X503  molex_microfit_3_01x2_THT  [MOLEX_MICROFIT_01x2_THT]

### Ports
PRIMARY-IN+, PRIMARY-IN-, PRIMARY-OUT+, PRIMARY-OUT-, SECONDARY-IN+, SECONDARY-IN-, SECONDARY-OUT+, SECONDARY-OUT-

### Nets
PRIMARY-IN+: X500.1 ; port PRIMARY-IN+
PRIMARY-IN-: X500.2 ; port PRIMARY-IN-
PRIMARY-OUT+: X501.1 ; port PRIMARY-OUT+
PRIMARY-OUT-: X501.2 ; port PRIMARY-OUT-
SECONDARY-IN+: X502.1 ; port SECONDARY-IN+
SECONDARY-IN-: X502.2 ; port SECONDARY-IN-
SECONDARY-OUT+: X503.1 ; port SECONDARY-OUT+
SECONDARY-OUT-: X503.2 ; port SECONDARY-OUT-

### Notes on the sheet
- Daisy Chain Connectors
- (near X500) 4x 2p connector equal for 12/15/18/20 cell version
- Primary Daisy-Chain
- Secondary Daisy-Chain
- Fraunhofer IISB
- Schottkystr. 10
- developed by:
- 91058 Erlangen
- Germany
- Author
- Project
- License
- Description
- File
- Version
- Release Date
- Sheet
- www.foxbms.org
- www.iisb.fraunhofer.de
- foxBMS Team
- /

### Library data of the parts
X500-X503 = molex_microfit_3_01x2_THT: Micro-Fit 3.0 Right Angle Header, 3.00mm Pitch, Dual Row, 2 Circuits, with Snap-in Plastic Peg PCB Lock, Tin, Glow Wire Capable, Black, 43045-0200; Manufacturer: Molex; Circuits: 2; Rated Voltage: 600V; Rated Current: 8.5A; Automotive Qualified: False; Part Number: molex_microfit_3_01x2_THT; Part Name: MicroFit; Operating Temperature: -40°C - +105°C; Supplier 1: Farnell; Supplier Part Number 1: 1012251

## Sheet ext_supply_con.SchDoc
size A3; DocumentNumber: 7; SheetNumber: 7; SheetTotal: 21; SheetDescription: External Power Supply Connector
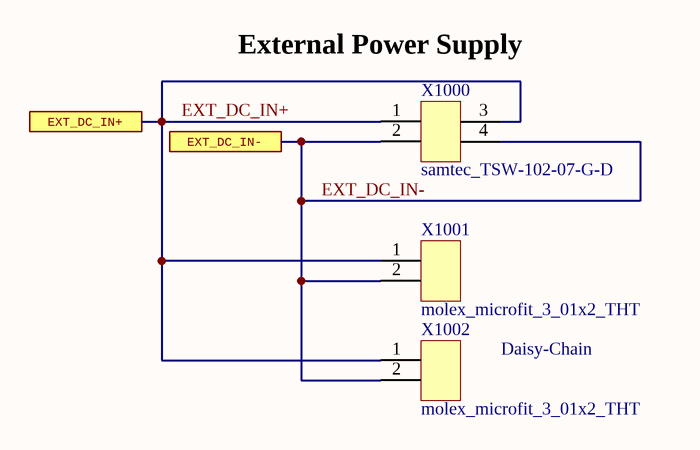
[diagram p17: ext_supply_con.SchDoc]

### Parts
X1000  samtec_TSW-102-07-G-D  [Pinheader_2.54_2x2]
X1001  molex_microfit_3_01x2_THT  [MOLEX_MICROFIT_01x2_THT]
X1002  molex_microfit_3_01x2_THT  [MOLEX_MICROFIT_01x2_THT]

### Ports
EXT_DC_IN+, EXT_DC_IN-

### Nets
EXT_DC_IN+: X1000.1 X1000.3 X1001.1 X1002.1 ; port EXT_DC_IN+
EXT_DC_IN-: X1000.2 X1000.4 X1001.2 X1002.2 ; port EXT_DC_IN-

### Notes on the sheet
- (near X1000) External Power Supply
- Daisy-Chain
- Fraunhofer IISB
- Schottkystr. 10
- developed by:
- 91058 Erlangen
- Germany
- Author
- Project
- License
- Description
- File
- Version
- Release Date
- Sheet
- www.foxbms.org
- www.iisb.fraunhofer.de
- foxBMS Team
- /

### Library data of the parts
X1000 = samtec_TSW-102-07-G-D: Board-To-Board Connector, Vertical, 2.54 mm, 4 Contacts, Header, TSW Series, Through Hole, 2 Rows; Manufacturer: Samtec; Circuits: 4; Rated Voltage: 500V AC mated with SSW; Automotive Qualified: False; Part Number: samtec_TSW-102-07-G-D; Part Name: TSW-102-07-G-D; Operating Temperature: -55°C - +125°C; ComponentLink1Description: Datasheet; ComponentLink1URL: http://www.farnell.com/datasheets/1992055.pdf; Supplier 1: Farnell; Supplier Part Number 1: 2025248
X1001 X1002 = molex_microfit_3_01x2_THT: as X500 on sheet daisy_chain_connectors; Part Number: molex_microfit_3_01x2_THT; Part Name: MicroFit; Operating Temperature: -40°C - +105°C; Supplier 1: Farnell; Supplier Part Number 1: 1012251

## Sheet bat_connectors.SchDoc
size A3; DocumentNumber: 2; SheetNumber: 2; SheetTotal: 21; SheetDescription: Connection to pack
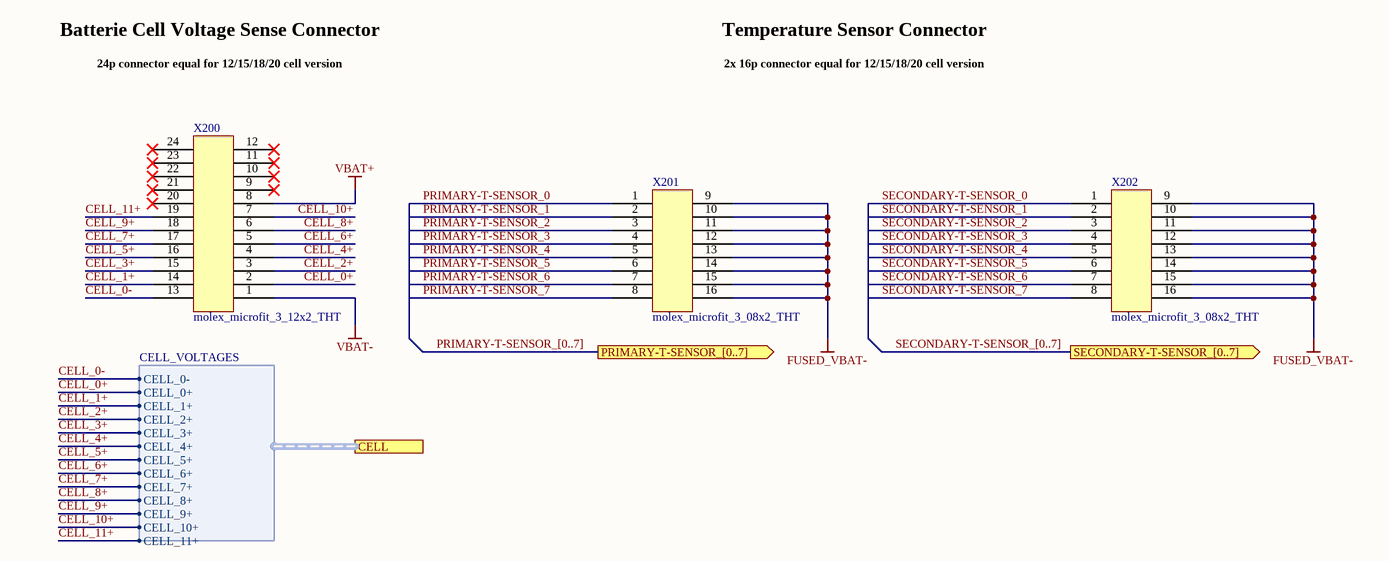
[diagram p18: bat_connectors.SchDoc]

### Parts
X200  molex_microfit_3_12x2_THT  [MOLEX_MICROFIT_12x2_THT]
X201  molex_microfit_3_08x2_THT  [MOLEX_MICROFIT_08x2_THT]
X202  molex_microfit_3_08x2_THT  [MOLEX_MICROFIT_08x2_THT]

### Ports
CELL (harness CELL_VOLTAGES), PRIMARY-T-SENSOR_[0..7] (out), SECONDARY-T-SENSOR_[0..7] (out)

### Harnesses
CELL_VOLTAGES: CELL_0-, CELL_0+, CELL_1+, CELL_2+, CELL_3+, CELL_4+, CELL_5+, CELL_6+, CELL_7+, CELL_8+, CELL_9+, CELL_10+, CELL_11+

### Nets
FUSED_VBAT-: X201.9 X201.10 X201.11 X201.12 X201.13 X201.14 X201.15 X201.16 X202.9 X202.10 X202.11 X202.12 X202.13 X202.14 X202.15 X202.16
VBAT+: X200.8
VBAT-: X200.1
CELL_0+: X200.2 ; port CELL.CELL_0+
CELL_0-: X200.13 ; port CELL.CELL_0-
CELL_1+: X200.14 ; port CELL.CELL_1+
CELL_2+: X200.3 ; port CELL.CELL_2+
CELL_3+: X200.15 ; port CELL.CELL_3+
CELL_4+: X200.4 ; port CELL.CELL_4+
CELL_5+: X200.16 ; port CELL.CELL_5+
CELL_6+: X200.5 ; port CELL.CELL_6+
CELL_7+: X200.17 ; port CELL.CELL_7+
CELL_8+: X200.6 ; port CELL.CELL_8+
CELL_9+: X200.18 ; port CELL.CELL_9+
CELL_10+: X200.7 ; port CELL.CELL_10+
CELL_11+: X200.19 ; port CELL.CELL_11+
PRIMARY-T-SENSOR_0: X201.1
PRIMARY-T-SENSOR_1: X201.2
PRIMARY-T-SENSOR_2: X201.3
PRIMARY-T-SENSOR_3: X201.4
PRIMARY-T-SENSOR_4: X201.5
PRIMARY-T-SENSOR_5: X201.6
PRIMARY-T-SENSOR_6: X201.7
PRIMARY-T-SENSOR_7: X201.8
SECONDARY-T-SENSOR_0: X202.1
SECONDARY-T-SENSOR_1: X202.2
SECONDARY-T-SENSOR_2: X202.3
SECONDARY-T-SENSOR_3: X202.4
SECONDARY-T-SENSOR_4: X202.5
SECONDARY-T-SENSOR_5: X202.6
SECONDARY-T-SENSOR_6: X202.7
SECONDARY-T-SENSOR_7: X202.8

Not connected (* = marked no-connect by the designer): X200 9* 10* 11* 12* 20* 21* 22* 23* 24*

### Buses and harness runs
bus PRIMARY-T-SENSOR_[0..7] = port PRIMARY-T-SENSOR_[0..7]
bus SECONDARY-T-SENSOR_[0..7] = port SECONDARY-T-SENSOR_[0..7]

### Notes on the sheet
- Batterie Cell Voltage Sense Connector
- 24p connector equal for 12/15/18/20 cell version
- Temperature Sensor Connector
- 2x 16p connector equal for 12/15/18/20 cell version
- Fraunhofer IISB
- Schottkystr. 10
- developed by:
- 91058 Erlangen
- Germany
- Author
- Project
- License
- Description
- File
- Version
- Release Date
- Sheet
- www.foxbms.org
- www.iisb.fraunhofer.de
- foxBMS Team
- /

### Library data of the parts
X200 = molex_microfit_3_12x2_THT: Micro-Fit 3.0 Right Angle Header, 3.00mm Pitch, Dual Row, 24 Circuits, with Snap-in Plastic Peg PCB Lock, Tin, Glow Wire Capable, Black, 43045-2400; Manufacturer: Molex; Circuits: 24; Rated Voltage: 600V; Rated Current: 8.5A; Automotive Qualified: False; Part Number: molex_microfit_3_12x2_THT; Part Name: MicroFit; Operating Temperature: -40°C - +105°C; Supplier 1: Farnell; Supplier Part Number 1: 1012245
X201 X202 = molex_microfit_3_08x2_THT: Micro-Fit 3.0 Right Angle Header, 3.00mm Pitch, Dual Row, 16 Circuits, with Snap-in Plastic Peg PCB Lock, Tin, Glow Wire Capable, Black, 43045-1600; Manufacturer: Molex; Circuits: 16; Rated Voltage: 600V; Rated Current: 8.5A; Automotive Qualified: False; Part Number: molex_microfit_3_08x2_THT; Part Name: MicroFit; Operating Temperature: -40°C - +105°C; Supplier 1: Farnell; Supplier Part Number 1: 9961380

## Sheet primary_dcdc_converter.SchDoc: foxBMS BMS-Slave 12-Cell
size A3; DocumentNumber: 11; SheetNumber: 11; SheetTotal: 21; AUTHOR: Fraunhofer IISB foxBMS Team; SheetDescription: DC/DC Converter
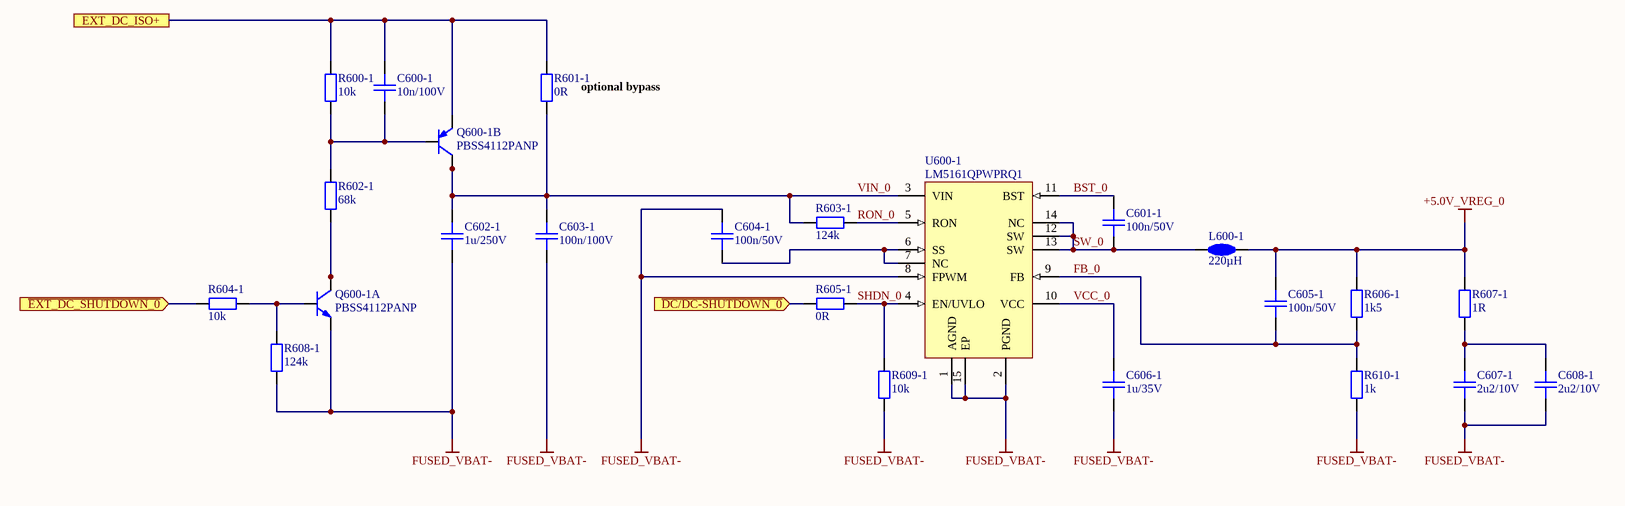
[diagram p19: primary_dcdc_converter.SchDoc]

### Parts
C600-1  10n/100V  [CAPC1608X08N]
C601-1  100n/50V  [CAPC1608X08N]
C602-1  1u/250V  [CAPC4532X16N]
C603-1  100n/100V  [CAPC2012X14N]
C604-1  100n/50V  [CAPC1608X08N]
C605-1  100n/50V  [CAPC1608X08N]
C606-1  1u/35V  [CAPC1608X08N]
C607-1  2u2/10V  [CAPC2012X14N]
C608-1  2u2/10V  [CAPC2012X14N]
L600-1  220µH  [TYS6045221M-10]
Q600-1  PBSS4112PANP  [PBSS4112PANP]  (parts A,B of 2)
R600-1  10k  [RESC1608X05N]
R601-1  0R  [RESC1608X05N]
R602-1  68k  [RESC1608X05N]
R603-1  124k  [RESC1608X05N]
R604-1  10k  [RESC1608X05N]
R605-1  0R  [RESC1608X05N]
R606-1  1k5  [RESC1608X05N]
R607-1  1R  [RESC2012X05N]
R608-1  124k  [RESC1608X05N]
R609-1  10k  [RESC1608X05N]
R610-1  1k  [RESC1608X05N]
U600-1  LM5161QPWPRQ1  [PWP0014A]

### Ports
EXT_DC_ISO+, ~{DC/DC-SHUTDOWN_0} (in), ~{EXT_DC_SHUTDOWN_0} (in)

### Nets
+5.0V_VREG_0: C605-1.2 L600-1.2 R606-1.1 R607-1.1
FUSED_VBAT-: C602-1.1 C603-1.1 C604-1.2 C606-1.2 C607-1.1 C608-1.1 Q600-1.1(E) R608-1.1 R609-1.2 R610-1.2 U600-1.1(AGND) U600-1.2(PGND) U600-1.8(FPWM) U600-1.15(EP)
BST_0: C601-1.2 U600-1.11(BST)
EXT_DC_ISO+: C600-1.1 Q600-1.4(E) R600-1.2 R601-1.2 ; port EXT_DC_ISO+
FB_0: C605-1.1 R606-1.2 R610-1.1 U600-1.9(FB)
LTC-Drive_0: R604-1.1 R605-1.2 ; port ~{DC/DC-SHUTDOWN_0}, port ~{EXT_DC_SHUTDOWN_0}
RON_0: R603-1.1 U600-1.5(RON)
SHDN_0: R605-1.1 R609-1.1 U600-1.4(EN/UVLO)
SW_0: C601-1.1 L600-1.1 U600-1.12(SW) U600-1.13(SW) U600-1.14(NC)
VCC_0: C606-1.1 U600-1.10(VCC)
VIN_0: C602-1.2 C603-1.2 Q600-1.3(C) Q600-1.8(C) R601-1.1 R603-1.2 U600-1.3(VIN)
NetC600-1_2: C600-1.2 Q600-1.5(B) R600-1.1 R602-1.2
NetC604-1_1: C604-1.1 U600-1.6(SS) U600-1.7(NC)
NetC607-1_2: C607-1.2 C608-1.2 R607-1.2
NetQ600-1_2: Q600-1.2(B) R604-1.2 R608-1.2
NetQ600-1_6: Q600-1.6(C) Q600-1.7(C) R602-1.1

### Notes on the sheet
- (near R601-1) optional bypass
- Fraunhofer IISB
- Schottkystr. 10
- developed by:
- 91058 Erlangen
- Germany
- Author
- Project
- License
- Description
- File
- Version
- Release Date
- Sheet
- www.foxbms.org
- www.iisb.fraunhofer.de
- foxBMS Team
- /

### Library data of the parts
C600-1 = gen_C_ceramic_10n_100V_X7R_0603: as C102-1 on sheet prim_analog_in; Part Number: gen_C_ceramic_10n_100V_X7R_0603; Supplier 1: Farnell; Supplier Part Number 1: 1301715; Supplier 2: Farnell; Supplier Part Number 2: 2821192; Supplier 3: Farnell; Supplier Part Number 3: 2210878
C601-1 C604-1 C605-1 = gen_C_ceramic_100n_50V_X7R_0603: as C700-1 on sheet primary_DIO; Part Number: gen_C_ceramic_100n_50V_X7R_0603; Supplier 1: Farnell; Supplier Part Number 1: 2525267; Supplier 2: Digikey; Supplier Part Number 2: 490-6049-1-ND; Supplier 3: Farnell; Supplier Part Number 3: 2070398
C602-1 = gen_C_ceramic_1u_250V_X7R_1812: MLCC; Capacitance: 1u; Rated Voltage: 250V; Dielectric: X7T; Case EIA: 1812; Case Metric: 4532; Automotive Qualified: True; Part Number: gen_C_ceramic_1u_250V_X7R_1812; Supplier 1: Farnell; Supplier Part Number 1: 2435499
C603-1 = gen_C_ceramic_100n_100V_X7R_0805: as C1400-1 on sheet primary_LTC; Part Number: gen_C_ceramic_100n_100V_X7R_0805; Supplier 1: Farnell; Supplier Part Number 1: 2320821
C606-1 = gen_C_ceramic_1u_35V_X7R_0603: as C1401-1 on sheet primary_LTC; Part Number: gen_C_ceramic_1u_35V_X7R_0603; Supplier 1: Farnell; Supplier Part Number 1: 1907508
C607-1 C608-1 = gen_C_ceramic_2u2_10V_X7R_0805: MLCC; Capacitance: 2u2; Rated Voltage: 10V; Dielectric: X7R; Case EIA: 0805; Case Metric: 2012; Automotive Qualified: True; Part Number: gen_C_ceramic_2u2_10V_X7R_0805; Supplier 1: Farnell; Supplier Part Number 1: 2478259; Supplier 2: Farnell; Supplier Part Number 2: 2070513
L600-1 = TYS6045221M-10: Power Inductor; Manufacturer: Laird-Signal Integrity Products; Rated Current: 590mA; Saturation Current: 700mA; Automotive Qualified: True; Part Number: TYS6045221M-10; Operating Temperature: -55°C - +150°C; ComponentLink1Description: Datasheet; ComponentLink1URL: http://assets.lairdtech.com/home/brandworld/files/TYS6045221M-10.pdf; Inductance: 220µH; Supplier 1: Digikey; Supplier Part Number 1: 240-2742-1-ND
Q600-1 = PBSS4112PANP: Dual NPN/PNP Transistor; Part Name: DUAL PNP/NPN; Manufacturer: Nexperia; Maximum Drain-Source Voltage: 120V; Maximum Continous Drain Current (25°C): 1A; Automotive Qualified: True; Part Number: PBSS4112PANP; Operating Temperature: -55°C - +150°C; ComponentLink1Description: Datasheet; ComponentLink1URL: https://assets.nexperia.com/documents/data-sheet/PBSS4112PANP.pdf; Supplier 2: Digikey; Supplier Part Number 2: 1727-1068-1-ND; Supplier 3: Mouser; Supplier Part Number 3: 771-PBSS4112PANP
R600-1 R604-1 R609-1 = gen_R_10k_0603: as R1404-1 on sheet primary_LTC; Part Number: gen_R_10k_0603; Operating Temperature: -55°C - +155°C; Resistance: 10k; Series: E24, E96; PnP Value: 10k; Supplier 1: Farnell; Supplier Part Number 1: 2073349
R601-1 R605-1 = gen_R_0R_0603: as R117-1 on sheet prim_analog_in; Part Number: gen_R_0R_0603; Operating Temperature: -55°C - +155°C; Resistance: 0R; Series: Jumper; PnP Value: 0R; Supplier 1: Farnell; Supplier Part Number 1: 2616580
R602-1 = gen_R_68k_0603: SMD Resistor 68k 0603; Tolerance: 1%; Power: 0.1W; Case EIA: 0603; Case Metric: 1608; Maximum Working Voltage: 75V; PnP Package: R_0603; Automotive Qualified: False; Part Number: gen_R_68k_0603; Operating Temperature: -55°C - +155°C; Resistance: 68k; Series: E24; PnP Value: 68k
R603-1 R608-1 = gen_R_124k_0603: SMD Resistor 124k 0603; Tolerance: 1%; Power: 0.1W; Case EIA: 0603; Case Metric: 1608; Maximum Working Voltage: 75V; PnP Package: R_0603; Automotive Qualified: True; Part Number: gen_R_124k_0603; Operating Temperature: -55°C - +155°C; Resistance: 124k; Series: E96; PnP Value: 124k; Supplier 1: Farnell; Supplier Part Number 1: 2138508
R606-1 = gen_R_1k5_0603: SMD Resistor 1k5 0603; Tolerance: 1%; Power: 0.1W; Case EIA: 0603; Case Metric: 1608; Maximum Working Voltage: 75V; PnP Package: R_0603; Automotive Qualified: True; Part Number: gen_R_1k5_0603; Operating Temperature: -55°C - +155°C; Resistance: 1k5; Series: E24, E96; PnP Value: 1k5; Supplier 1: Farnell; Supplier Part Number 1: 2616745
R607-1 = gen_R_1R_0805: SMD Resistor 1R 0805; Tolerance: 1%; Power: 0.125W; Case EIA: 0805; Case Metric: 2012; Maximum Working Voltage: 150V; PnP Package: R_0805; Automotive Qualified: True; Part Number: gen_R_1R_0805; Operating Temperature: -55°C - +155°C; Resistance: 1R; Series: E24, E96; PnP Value: 1R; Supplier 1: Farnell; Supplier Part Number 1: 2616757
R610-1 = gen_R_1k_0603: SMD Resistor 1k 0603; Tolerance: 1%; Power: 0.1W; Case EIA: 0603; Case Metric: 1608; Maximum Working Voltage: 75V; PnP Package: R_0603; Automotive Qualified: True; PnP equipped: x; Part Number: gen_R_1k_0603; Operating Temperature: -55°C - +155°C; Resistance: 1k; Series: E24, E96; PnP Value: 1k; Supplier 1: Farnell; Supplier Part Number 1: 1652848
U600-1 = LM5161QPWPRQ1: Automotive DC/DC buck converter; Manufacturer: Texas Instruments; PnP Package: HTSSOP-14; Automotive Qualified: True; Part Number: LM5161QPWPRQ1; Part Name: LM5161QPWPRQ1; Operating Temperature: −40°C - +125°C; Supplier 1: Digikey; Supplier Part Number 1: 296-47791-1-ND; Supplier 2: Mouser; Supplier Part Number 2: 595-LM5161QPWPRQ1

## Sheet secondary_dcdc_converter.SchDoc: foxBMS BMS-Slave 12-Cell
size A3; DocumentNumber: 17; SheetNumber: 17; SheetTotal: 21; AUTHOR: Fraunhofer IISB foxBMS Team; SheetDescription: DC/DC Converter
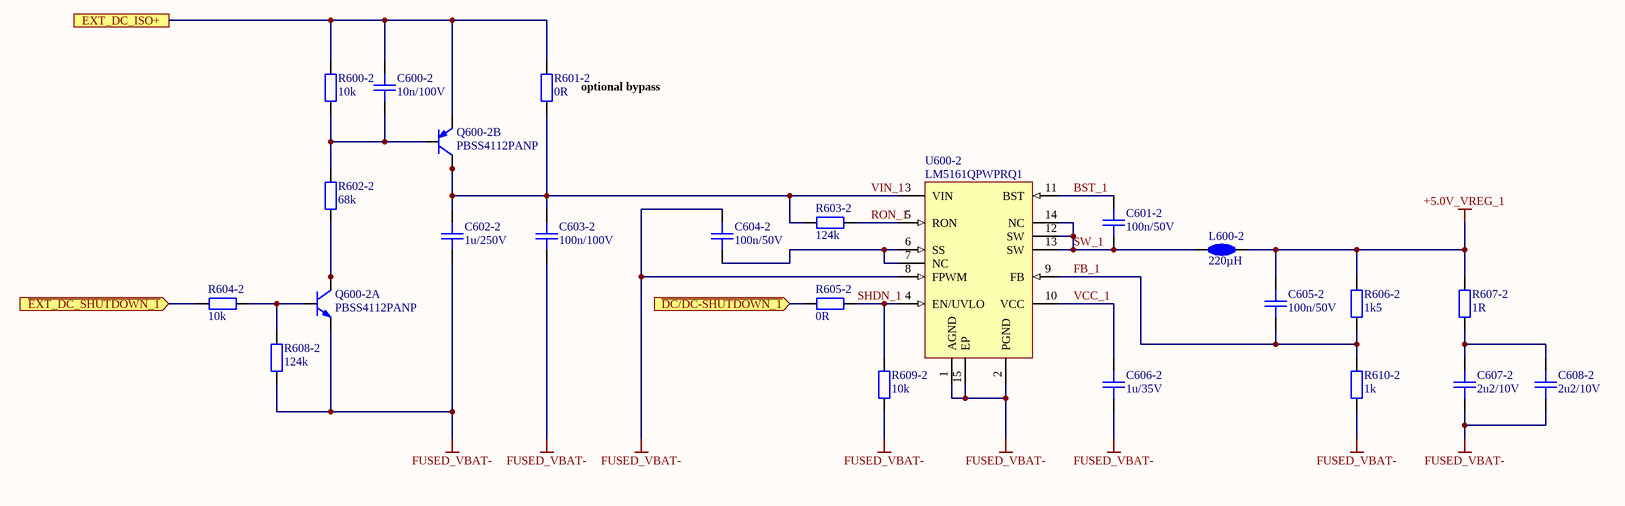
[diagram p20: secondary_dcdc_converter.SchDoc]

### Parts
C600-2  10n/100V  [CAPC1608X08N]
C601-2  100n/50V  [CAPC1608X08N]
C602-2  1u/250V  [CAPC4532X16N]
C603-2  100n/100V  [CAPC2012X14N]
C604-2  100n/50V  [CAPC1608X08N]
C605-2  100n/50V  [CAPC1608X08N]
C606-2  1u/35V  [CAPC1608X08N]
C607-2  2u2/10V  [CAPC2012X14N]
C608-2  2u2/10V  [CAPC2012X14N]
L600-2  220µH  [TYS6045221M-10]
Q600-2  PBSS4112PANP  [PBSS4112PANP]  (parts A,B of 2)
R600-2  10k  [RESC1608X05N]
R601-2  0R  [RESC1608X05N]
R602-2  68k  [RESC1608X05N]
R603-2  124k  [RESC1608X05N]
R604-2  10k  [RESC1608X05N]
R605-2  0R  [RESC1608X05N]
R606-2  1k5  [RESC1608X05N]
R607-2  1R  [RESC2012X05N]
R608-2  124k  [RESC1608X05N]
R609-2  10k  [RESC1608X05N]
R610-2  1k  [RESC1608X05N]
U600-2  LM5161QPWPRQ1  [PWP0014A]

### Ports
EXT_DC_ISO+, ~{DC/DC-SHUTDOWN_1} (in), ~{EXT_DC_SHUTDOWN_1} (in)

### Nets
+5.0V_VREG_1: C605-2.2 L600-2.2 R606-2.1 R607-2.1
FUSED_VBAT-: C602-2.1 C603-2.2 C604-2.2 C606-2.2 C607-2.1 C608-2.1 Q600-2.1(E) R608-2.1 R609-2.2 R610-2.2 U600-2.1(AGND) U600-2.2(PGND) U600-2.8(FPWM) U600-2.15(EP)
BST_1: C601-2.2 U600-2.11(BST)
EXT_DC_ISO+: C600-2.1 Q600-2.4(E) R600-2.2 R601-2.2 ; port EXT_DC_ISO+
FB_1: C605-2.1 R606-2.2 R610-2.1 U600-2.9(FB)
LTC-Drive_1: R604-2.1 R605-2.2 ; port ~{DC/DC-SHUTDOWN_1}, port ~{EXT_DC_SHUTDOWN_1}
RON_1: R603-2.1 U600-2.5(RON)
SHDN_1: R605-2.1 R609-2.1 U600-2.4(EN/UVLO)
SW_1: C601-2.1 L600-2.1 U600-2.12(SW) U600-2.13(SW) U600-2.14(NC)
VCC_1: C606-2.1 U600-2.10(VCC)
VIN_1: C602-2.2 C603-2.1 Q600-2.3(C) Q600-2.8(C) R601-2.1 R603-2.2 U600-2.3(VIN)
NetC600-2_2: C600-2.2 Q600-2.5(B) R600-2.1 R602-2.2
NetC604-2_1: C604-2.1 U600-2.6(SS) U600-2.7(NC)
NetC607-2_2: C607-2.2 C608-2.2 R607-2.2
NetQ600-2_2: Q600-2.2(B) R604-2.2 R608-2.2
NetQ600-2_6: Q600-2.6(C) Q600-2.7(C) R602-2.1

### Notes on the sheet
- (near R601-2) optional bypass
- Fraunhofer IISB
- Schottkystr. 10
- developed by:
- 91058 Erlangen
- Germany
- Author
- Project
- License
- Description
- File
- Version
- Release Date
- Sheet
- www.foxbms.org
- www.iisb.fraunhofer.de
- foxBMS Team
- /

### Library data of the parts
C600-2 = gen_C_ceramic_10n_100V_X7R_0603: MLCC; Capacitance: 10n; Rated Voltage: 100V; Dielectric: X7R; Case EIA: 0603; Case Metric: 1608; Automotive Qualified: True; PnP Package: C_0603_10; PnP Value: 10n/100V/X7R; Part Number: gen_C_ceramic_10n_100V_X7R_0603; Supplier 1: Farnell; Supplier Part Number 1: 1301715; Supplier 2: Farnell; Supplier Part Number 2: 2821192; Supplier 3: Farnell; Supplier Part Number 3: 2210878
C601-2 C604-2 C605-2 = gen_C_ceramic_100n_50V_X7R_0603: MLCC; Capacitance: 100n; Rated Voltage: 50V; Dielectric: X7R; Case EIA: 0603; Case Metric: 1608; PnP Package: C_0603_10; PnP Value: 100n/50V/X7R; PnP equipped: x; Automotive Qualified: True; Part Number: gen_C_ceramic_100n_50V_X7R_0603; Supplier 1: Farnell; Supplier Part Number 1: 2525267; Supplier 2: Digikey; Supplier Part Number 2: 490-6049-1-ND; Supplier 3: Farnell; Supplier Part Number 3: 2070398
C602-2 = gen_C_ceramic_1u_250V_X7R_1812: MLCC; Capacitance: 1u; Rated Voltage: 250V; Dielectric: X7T; Case EIA: 1812; Case Metric: 4532; Automotive Qualified: True; Part Number: gen_C_ceramic_1u_250V_X7R_1812; Supplier 1: Farnell; Supplier Part Number 1: 2435499
C603-2 = gen_C_ceramic_100n_100V_X7R_0805: MLCC; Capacitance: 100n; Rated Voltage: 100V; Dielectric: X7R; Case EIA: 0805; Case Metric: 2012; Automotive Qualified: False; Part Number: gen_C_ceramic_100n_100V_X7R_0805; Supplier 1: Farnell; Supplier Part Number 1: 2320821
C606-2 = gen_C_ceramic_1u_35V_X7R_0603: MLCC; Capacitance: 1u; Rated Voltage: 35V; Dielectric: X7R; Case EIA: 0603; Case Metric: 1608; PnP Package: C_0603_10; PnP Value: 1uF/35V/X7R; PnP equipped: x; Automotive Qualified: False; Part Number: gen_C_ceramic_1u_35V_X7R_0603; Supplier 1: Farnell; Supplier Part Number 1: 1907508
C607-2 C608-2 = gen_C_ceramic_2u2_10V_X7R_0805: MLCC; Capacitance: 2u2; Rated Voltage: 10V; Dielectric: X7R; Case EIA: 0805; Case Metric: 2012; Automotive Qualified: True; Part Number: gen_C_ceramic_2u2_10V_X7R_0805; Supplier 1: Farnell; Supplier Part Number 1: 2478259; Supplier 2: Farnell; Supplier Part Number 2: 2070513
L600-2 = TYS6045221M-10: Power Inductor; Manufacturer: Laird-Signal Integrity Products; Rated Current: 590mA; Saturation Current: 700mA; Automotive Qualified: True; Part Number: TYS6045221M-10; Operating Temperature: -55°C - +150°C; ComponentLink1Description: Datasheet; ComponentLink1URL: http://assets.lairdtech.com/home/brandworld/files/TYS6045221M-10.pdf; Inductance: 220µH; Supplier 1: Digikey; Supplier Part Number 1: 240-2742-1-ND
Q600-2 = PBSS4112PANP: Dual NPN/PNP Transistor; Part Name: DUAL PNP/NPN; Manufacturer: Nexperia; Maximum Drain-Source Voltage: 120V; Maximum Continous Drain Current (25°C): 1A; Automotive Qualified: True; Part Number: PBSS4112PANP; Operating Temperature: -55°C - +150°C; ComponentLink1Description: Datasheet; ComponentLink1URL: https://assets.nexperia.com/documents/data-sheet/PBSS4112PANP.pdf; Supplier 2: Digikey; Supplier Part Number 2: 1727-1068-1-ND; Supplier 3: Mouser; Supplier Part Number 3: 771-PBSS4112PANP
R600-2 R604-2 R609-2 = gen_R_10k_0603: SMD Resistor 10k 0603; Tolerance: 1%; Power: 0.1W; Case EIA: 0603; Case Metric: 1608; Maximum Working Voltage: 75V; PnP Package: R_0603; Automotive Qualified: True; Part Number: gen_R_10k_0603; Operating Temperature: -55°C - +155°C; Resistance: 10k; Series: E24, E96; PnP Value: 10k; Supplier 1: Farnell; Supplier Part Number 1: 2073349
R601-2 R605-2 = gen_R_0R_0603: SMD Resistor 0R 0603; Power: 0.1W; Case EIA: 0603; Case Metric: 1608; Maximum Working Voltage: 75V; PnP Package: R_0603; Automotive Qualified: True; Part Number: gen_R_0R_0603; Operating Temperature: -55°C - +155°C; Resistance: 0R; Series: Jumper; PnP Value: 0R; Supplier 1: Farnell; Supplier Part Number 1: 2616580
R602-2 = gen_R_68k_0603: SMD Resistor 68k 0603; Tolerance: 1%; Power: 0.1W; Case EIA: 0603; Case Metric: 1608; Maximum Working Voltage: 75V; PnP Package: R_0603; Automotive Qualified: False; Part Number: gen_R_68k_0603; Operating Temperature: -55°C - +155°C; Resistance: 68k; Series: E24; PnP Value: 68k
R603-2 R608-2 = gen_R_124k_0603: SMD Resistor 124k 0603; Tolerance: 1%; Power: 0.1W; Case EIA: 0603; Case Metric: 1608; Maximum Working Voltage: 75V; PnP Package: R_0603; Automotive Qualified: True; Part Number: gen_R_124k_0603; Operating Temperature: -55°C - +155°C; Resistance: 124k; Series: E96; PnP Value: 124k; Supplier 1: Farnell; Supplier Part Number 1: 2138508
R606-2 = gen_R_1k5_0603: SMD Resistor 1k5 0603; Tolerance: 1%; Power: 0.1W; Case EIA: 0603; Case Metric: 1608; Maximum Working Voltage: 75V; PnP Package: R_0603; Automotive Qualified: True; Part Number: gen_R_1k5_0603; Operating Temperature: -55°C - +155°C; Resistance: 1k5; Series: E24, E96; PnP Value: 1k5; Supplier 1: Farnell; Supplier Part Number 1: 2616745
R607-2 = gen_R_1R_0805: SMD Resistor 1R 0805; Tolerance: 1%; Power: 0.125W; Case EIA: 0805; Case Metric: 2012; Maximum Working Voltage: 150V; PnP Package: R_0805; Automotive Qualified: True; Part Number: gen_R_1R_0805; Operating Temperature: -55°C - +155°C; Resistance: 1R; Series: E24, E96; PnP Value: 1R; Supplier 1: Farnell; Supplier Part Number 1: 2616757
R610-2 = gen_R_1k_0603: SMD Resistor 1k 0603; Tolerance: 1%; Power: 0.1W; Case EIA: 0603; Case Metric: 1608; Maximum Working Voltage: 75V; PnP Package: R_0603; Automotive Qualified: True; PnP equipped: x; Part Number: gen_R_1k_0603; Operating Temperature: -55°C - +155°C; Resistance: 1k; Series: E24, E96; PnP Value: 1k; Supplier 1: Farnell; Supplier Part Number 1: 1652848
U600-2 = LM5161QPWPRQ1: Automotive DC/DC buck converter; Manufacturer: Texas Instruments; PnP Package: HTSSOP-14; Automotive Qualified: True; Part Number: LM5161QPWPRQ1; Part Name: LM5161QPWPRQ1; Operating Temperature: −40°C - +125°C; Supplier 1: Digikey; Supplier Part Number 1: 296-47791-1-ND; Supplier 2: Mouser; Supplier Part Number 2: 595-LM5161QPWPRQ1